# EasyEDA Pro project ProPrj_四关开Buck-Boost开关电路_V1.2_2026-08-30.epro

# Schematic Schematic1

## Sheets
1 辅助电源&主控芯片: Assembly Variant: Basic; Board Name: Board1; Create Date: 2025-11-25; Page Name: P1; Project Name: 四关开Buck-Boost开关电路; Schematic Name: Schematic1; Update Date: 2025-11-25; Company: 嘉立创EDA; Page Size: A4; Version: V1.0
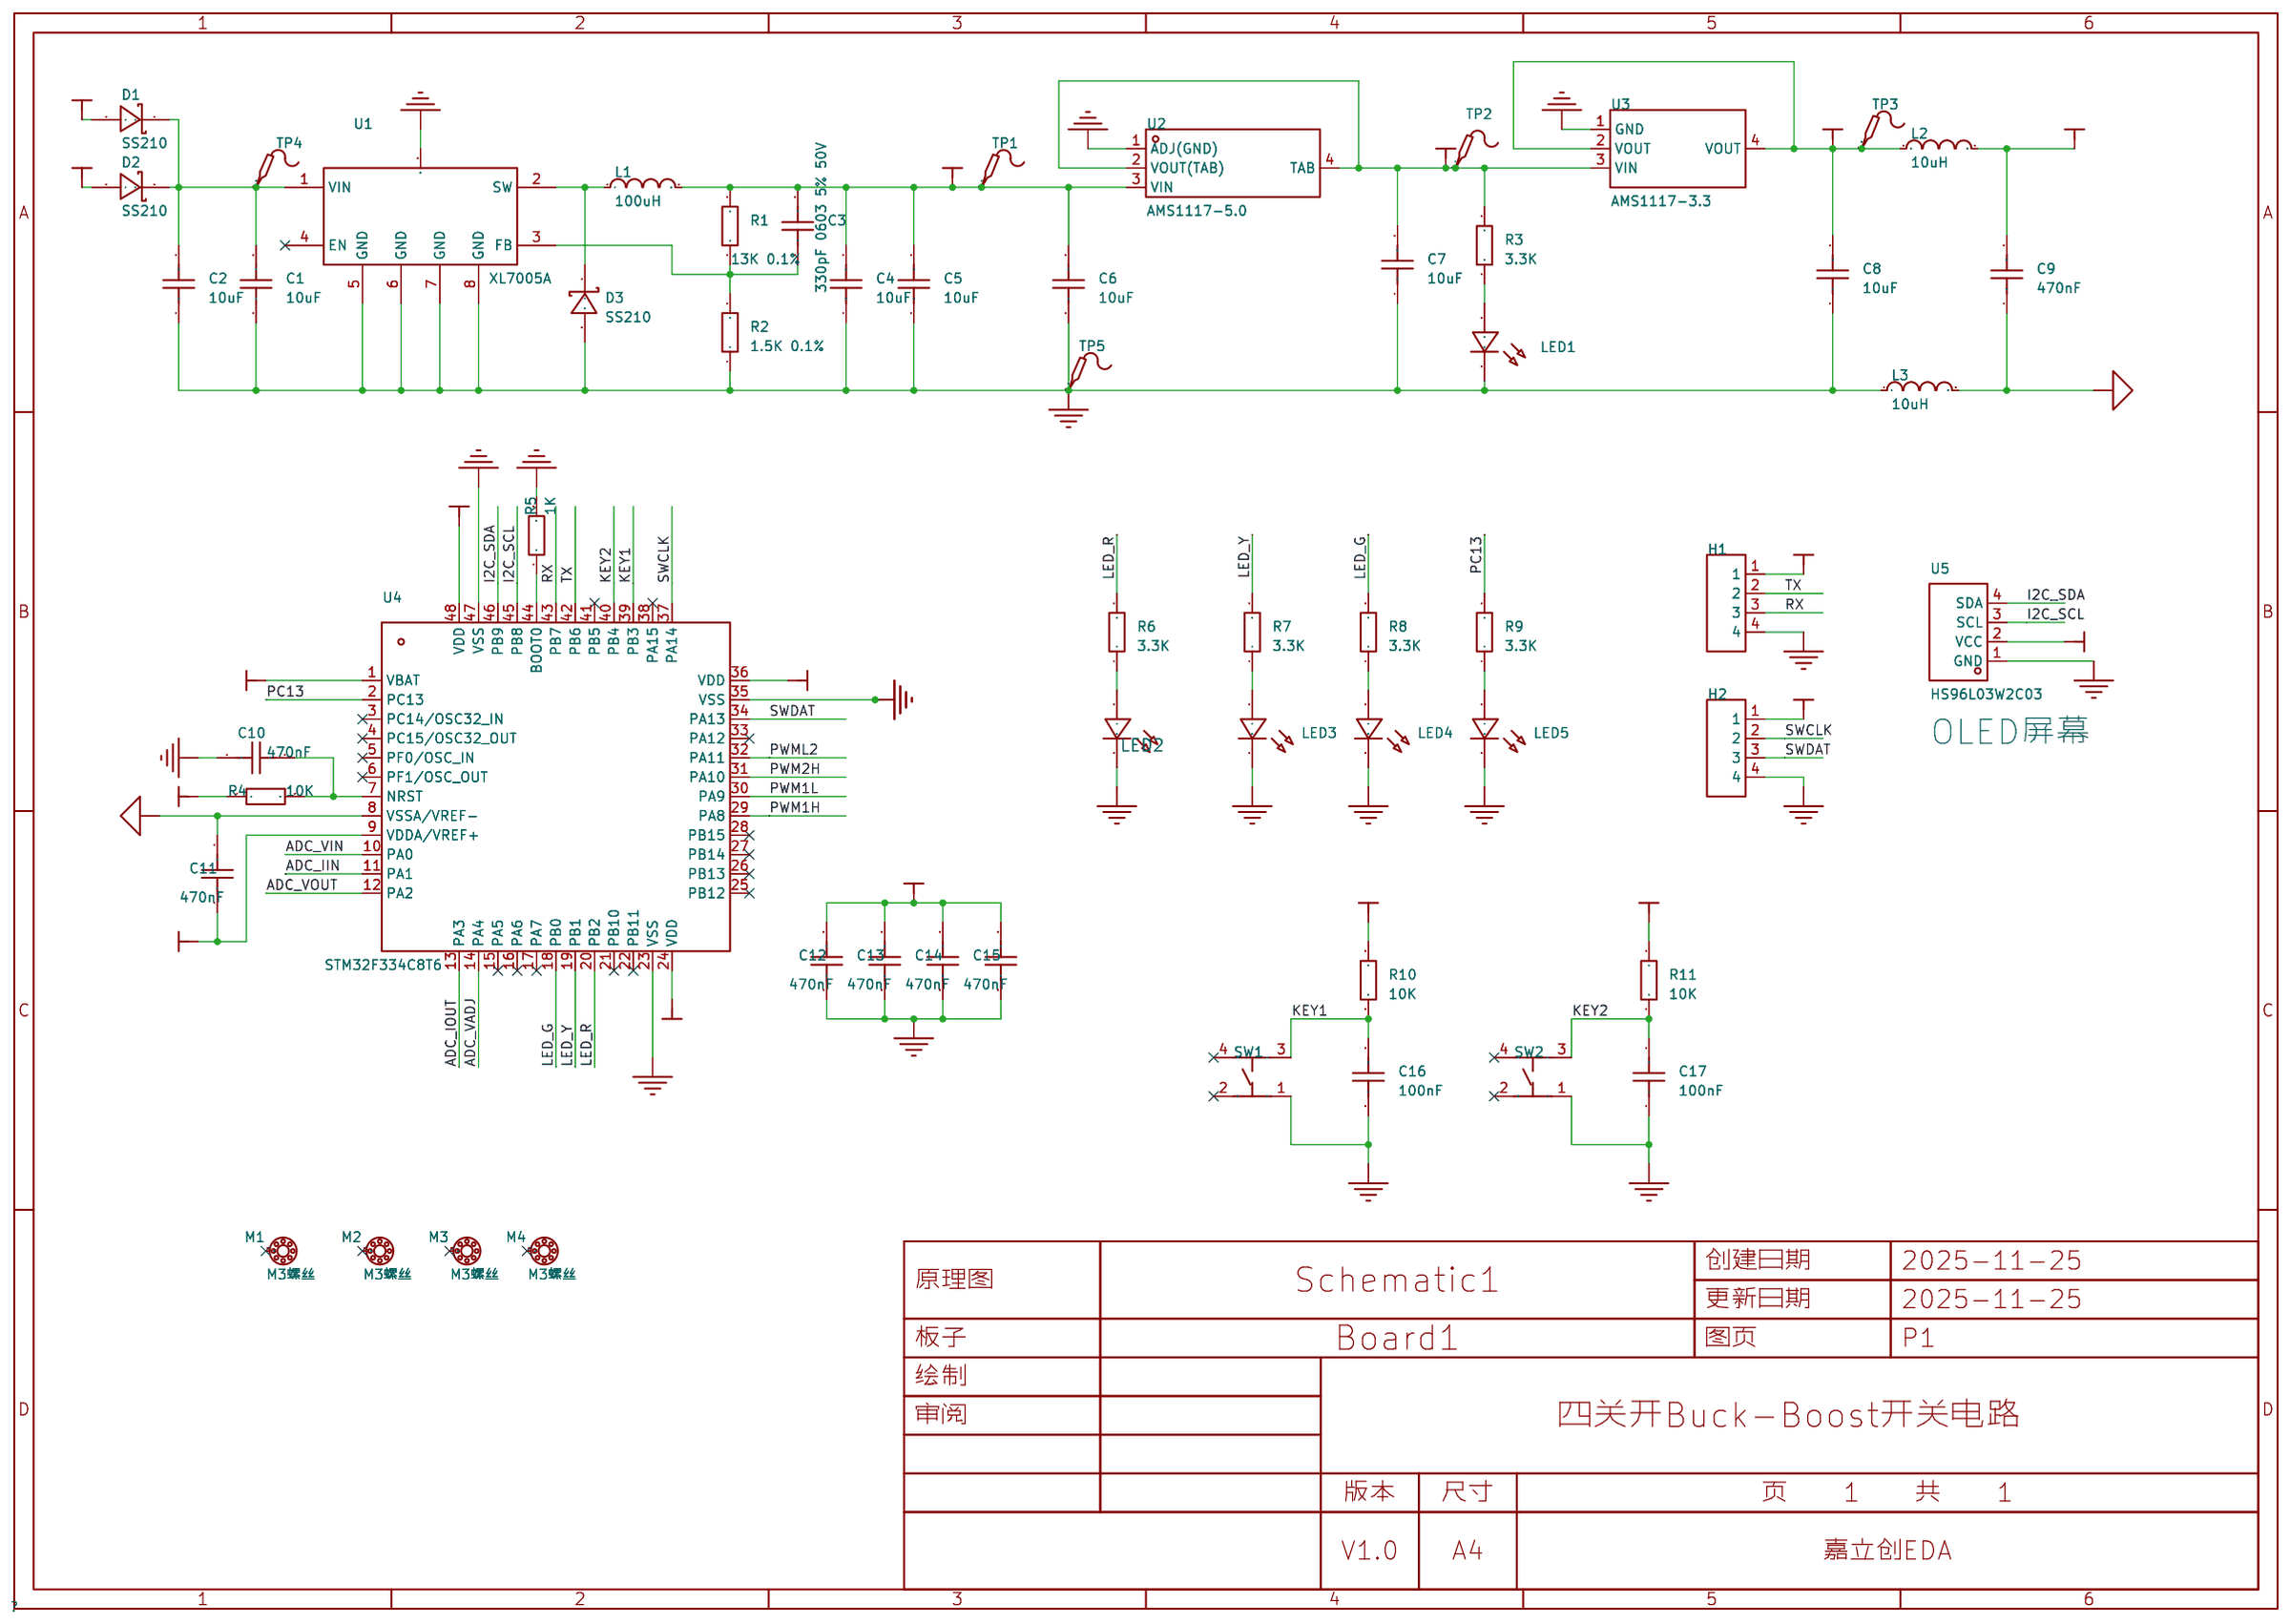
[diagram p0: 辅助电源&主控芯片]
2 主功率&驱动: Page Name: P2
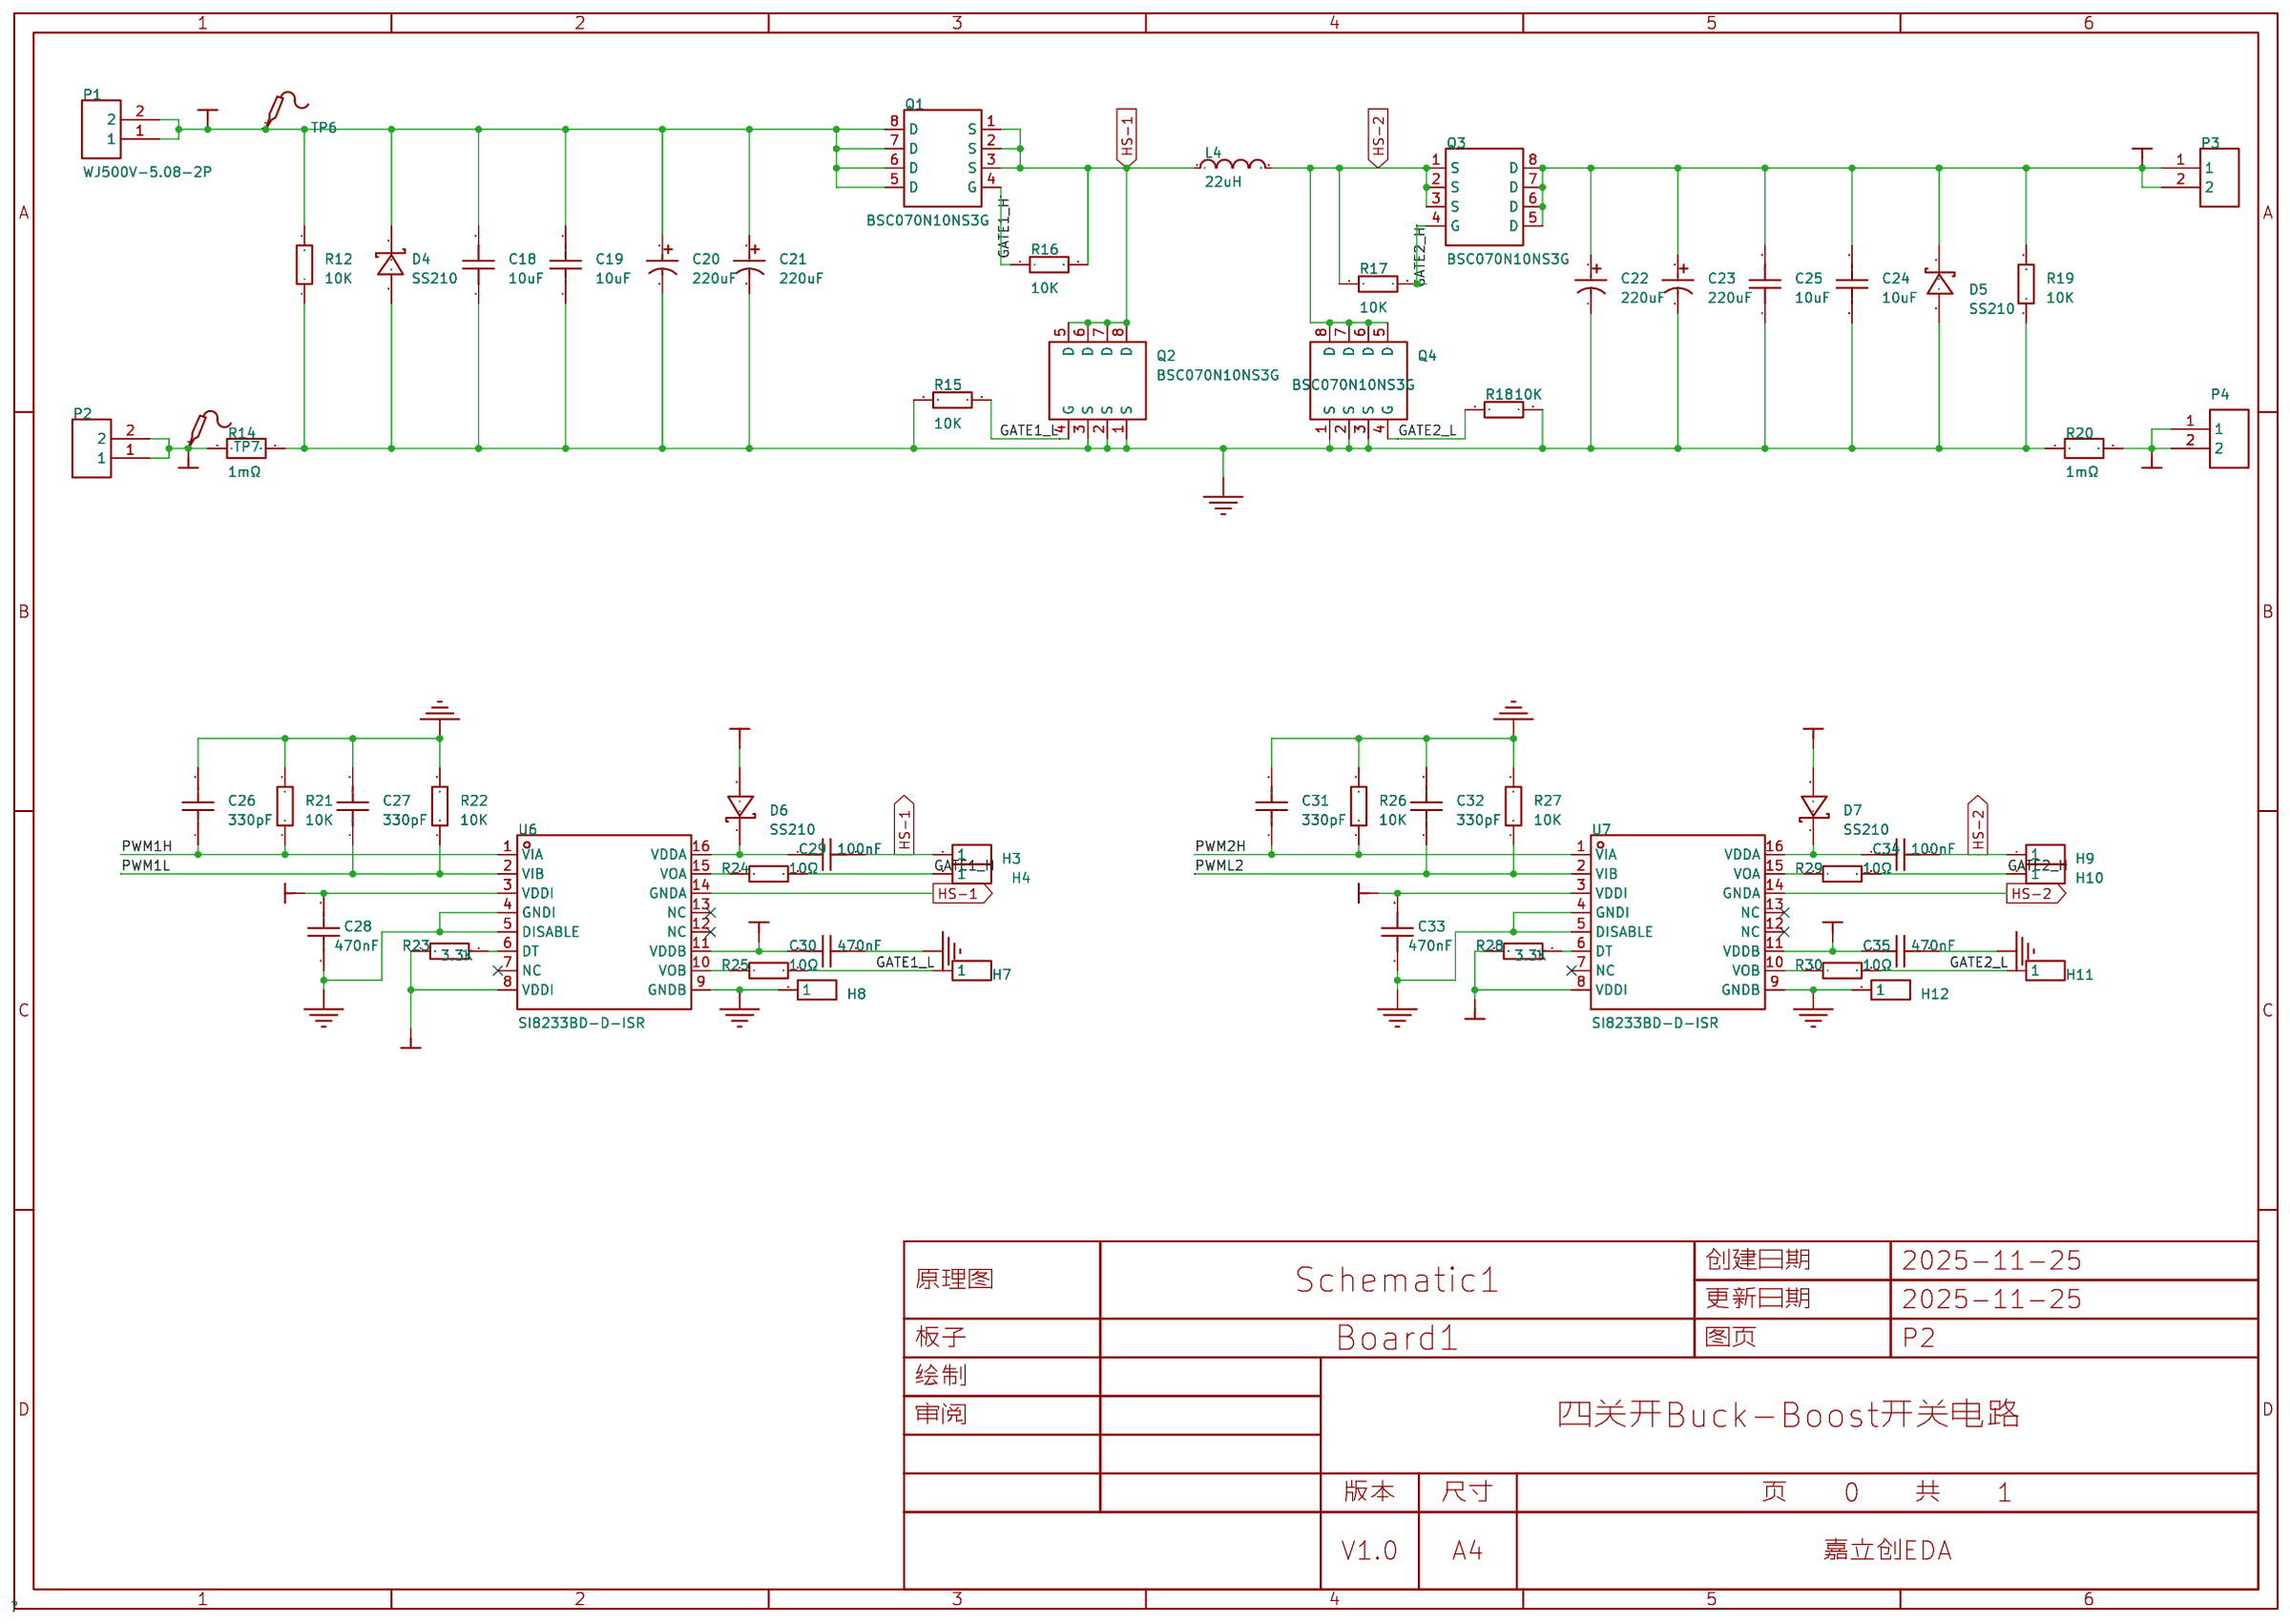
[diagram p1: 主功率&驱动]
3 信号处理: Create Date: 2025-11-26; Page Name: P3; Update Date: 2025-11-26
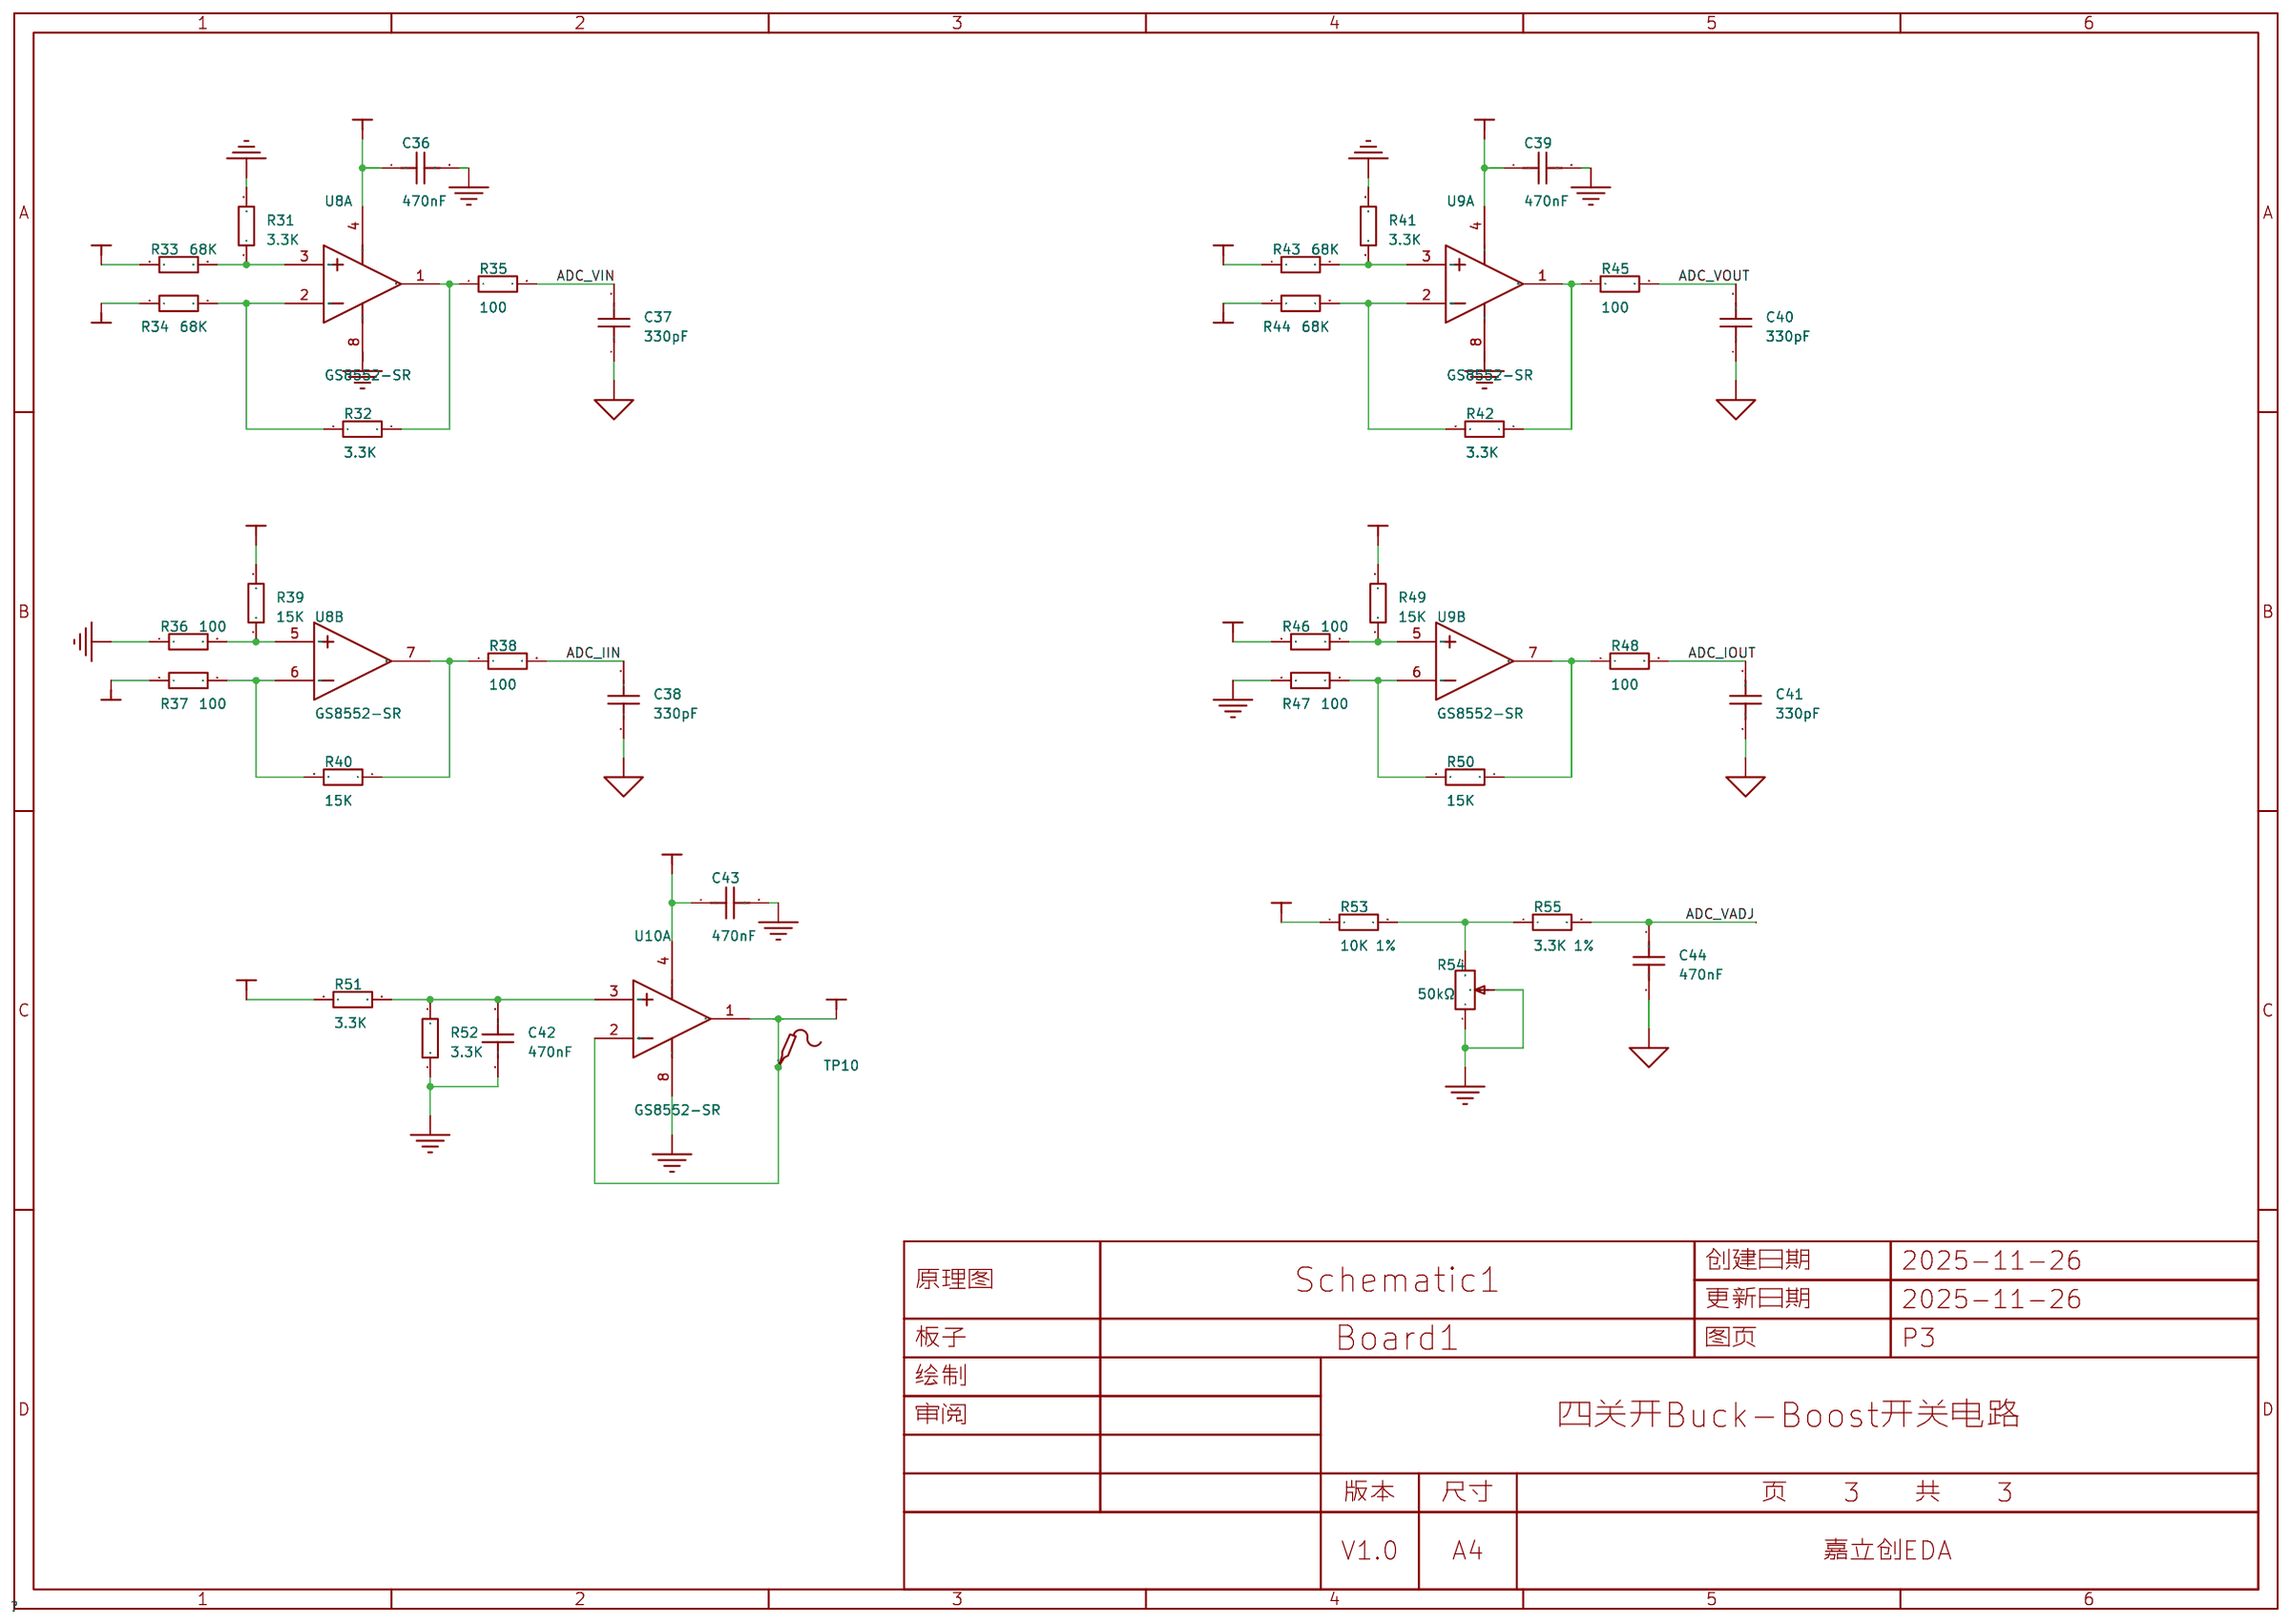
[diagram p2: 信号处理]

## Parts
sheet 主功率&驱动
C18  10uF  [C0805]
C19  10uF  [C0805]
C20  220uF  [CAP-TH_BD10.0-P5.00-D1.0-FD]
C21  220uF  [CAP-TH_BD10.0-P5.00-D1.0-FD]
C22  220uF  [CAP-TH_BD10.0-P5.00-D1.0-FD]
C23  220uF  [CAP-TH_BD10.0-P5.00-D1.0-FD]
C24  10uF  [C0805]
C25  10uF  [C0805]
C26  330pF  [C0603]
C27  330pF  [C0603]
C28  470nF  [C0603]
C29  100nF  [C0603]
C30  470nF  [C0603]
C31  330pF  [C0603]
C32  330pF  [C0603]
C33  470nF  [C0603]
C34  100nF  [C0603]
C35  470nF  [C0603]
D4  SS210  [SMA_L4.4-W2.8-LS5.4-RD]
D5  SS210  [SMA_L4.4-W2.8-LS5.4-RD]
D6  SS210  [SMA_L4.4-W2.8-LS5.4-RD]
D7  SS210  [SMA_L4.4-W2.8-LS5.4-RD]
H3  -  [HDR-TH_1P-V-M_XKB_X4611WV-01I-C28D40]
H4  -  [HDR-TH_1P-V-M_XKB_X4611WV-01I-C28D40]
H7  -  [HDR-TH_1P-V-M_XKB_X4611WV-01I-C28D40]
H8  -  [HDR-TH_1P-V-M_XKB_X4611WV-01I-C28D40]
H9  -  [HDR-TH_1P-V-M_XKB_X4611WV-01I-C28D40]
H10  -  [HDR-TH_1P-V-M_XKB_X4611WV-01I-C28D40]
H11  -  [HDR-TH_1P-V-M_XKB_X4611WV-01I-C28D40]
H12  -  [HDR-TH_1P-V-M_XKB_X4611WV-01I-C28D40]
L4  22uH  [IND-SMD_L17.5-W17.0_YXMAC1770]
P1  WJ500V-5.08-2P  [CONN-TH_2P-P5.00_WJ500V-5.08-2P]
P2  WJ500V-5.08-2P  [CONN-TH_2P-P5.00_WJ500V-5.08-2P]
P3  WJ500V-5.08-2P  [CONN-TH_2P-P5.00_WJ500V-5.08-2P]
P4  WJ500V-5.08-2P  [CONN-TH_2P-P5.00_WJ500V-5.08-2P]
Q1  BSC070N10NS3G  [PG-TDSON-8_L5.0-W6.0-P1.27-BL-EP]
Q2  BSC070N10NS3G  [PG-TDSON-8_L5.0-W6.0-P1.27-BL-EP]
Q3  BSC070N10NS3G  [PG-TDSON-8_L5.0-W6.0-P1.27-BL-EP]
Q4  BSC070N10NS3G  [PG-TDSON-8_L5.0-W6.0-P1.27-BL-EP]
R12  10K  [R0603]
R14  1mΩ  [RES-SMD_L6.3-W3.2_R2512]
R15  10K  [R0603]
R16  10K  [R0603]
R17  10K  [R0603]
R18  10K  [R0603]
R19  10K  [R0603]
R20  1mΩ  [RES-SMD_L6.3-W3.2_R2512]
R21  10K  [R0603]
R22  10K  [R0603]
R23  3.3K  [R0603]
R24  10Ω  [R0603]
R25  10Ω  [R0603]
R26  10K  [R0603]
R27  10K  [R0603]
R28  3.3K  [R0603]
R29  10Ω  [R0603]
R30  10Ω  [R0603]
TP6  -  [Test-Point-0.5mm]
TP7  -  [Test-Point-0.5mm]
U6  SI8233BD-D-ISR  [SOIC-16_L10.3-W7.5-P1.27-LS10.3-BL]
U7  SI8233BD-D-ISR  [SOIC-16_L10.3-W7.5-P1.27-LS10.3-BL]
sheet 信号处理
C36  470nF  [C0603]
C37  330pF  [C0603]
C38  330pF  [C0603]
C39  470nF  [C0603]
C40  330pF  [C0603]
C41  330pF  [C0603]
C42  470nF  [C0603]
C43  470nF  [C0603]
C44  470nF  [C0603]
R31  3.3K  [R0603]
R32  3.3K  [R0603]
R33  68K  [R0603]
R34  68K  [R0603]
R35  100  [R0603]
R36  100  [R0603]
R37  100  [R0603]
R38  100  [R0603]
R39  15K  [R0603]
R40  15K  [R0603]
R41  3.3K  [R0603]
R42  3.3K  [R0603]
R43  68K  [R0603]
R44  68K  [R0603]
R45  100  [R0603]
R46  100  [R0603]
R47  100  [R0603]
R48  100  [R0603]
R49  15K  [R0603]
R50  15K  [R0603]
R51  3.3K  [R0603]
R52  3.3K  [R0603]
R53  10K 1%  [R0603]
R54  50kΩ  [RES-ADJ-TH_3296W]
R55  3.3K 1%  [R0603]
TP10  -  [Test-Point-0.5mm]
U8  GS8552-SR  [SOIC-8_L4.9-W3.9-P1.27-LS6.0-BL]  (sections 1,2)
U9  GS8552-SR  [SOIC-8_L4.9-W3.9-P1.27-LS6.0-BL]  (sections 1,2)
U10  GS8552-SR  [SOIC-8_L4.9-W3.9-P1.27-LS6.0-BL]  (section 1)
sheet 辅助电源&主控芯片
C1  10uF  [C0805]
C2  10uF  [C0805]
C3  330pF 0603 5% 50V  [C0603]
C4  10uF  [C0805]
C5  10uF  [C0805]
C6  10uF  [C0805]
C7  10uF  [C0805]
C8  10uF  [C0805]
C9  470nF  [C0603]
C10  470nF  [C0603]
C11  470nF  [C0603]
C12  470nF  [C0603]
C13  470nF  [C0603]
C14  470nF  [C0603]
C15  470nF  [C0603]
C16  100nF  [C0603]
C17  100nF  [C0603]
D1  SS210  [SMA_L4.4-W2.8-LS5.4-RD]
D2  SS210  [SMA_L4.4-W2.8-LS5.4-RD]
D3  SS210  [SMA_L4.4-W2.8-LS5.4-RD]
H1  -  [HDR-TH_4P-P2.54-V-M]
H2  -  [HDR-TH_4P-P2.54-V-M]
L1  100uH  [IND-SMD_L6.0-W6.0_FNR60XXS]
L2  10uH  [L0603]
L3  10uH  [L0603]
LED1  -  [LED_0603]
LED2  -  [LED_0603]
LED3  -  [LED_0603]
LED4  -  [LED_0603]
LED5  -  [LED_0603]
M1  M3螺丝  [螺钉孔]
M2  M3螺丝  [螺钉孔]
M3  M3螺丝  [螺钉孔]
M4  M3螺丝  [螺钉孔]
R1  13K 0.1%  [R0603]
R2  1.5K 0.1%  [R0603]
R3  3.3K  [R0603]
R4  10K  [R0603]
R5  1K  [R0603]
R6  3.3K  [R0603]
R7  3.3K  [R0603]
R8  3.3K  [R0603]
R9  3.3K  [R0603]
R10  10K  [R0603]
R11  10K  [R0603]
SW1  KH-6X6X5H-STM  [SW-SMD_4P-L6.0-W6.0-P4.50-LS9.0_H5.0]
SW2  KH-6X6X5H-STM  [SW-SMD_4P-L6.0-W6.0-P4.50-LS9.0_H5.0]
TP1  -  [Test-Point-0.5mm]
TP2  -  [Test-Point-0.5mm]
TP3  -  [Test-Point-0.5mm]
TP4  -  [Test-Point-0.5mm]
TP5  -  [Test-Point-0.5mm]
U1  XL7005A  [SOIC-8_L4.9-W3.9-P1.27-LS6.0-BL-EP3.1-1]
U2  AMS1117-5.0  [SOT-223_L6.7-W3.5-P2.30-BR]
U3  AMS1117-3.3  [SOT-223-3_L6.5-W3.4-P2.30-LS7.0-BR]
U4  STM32F334C8T6  [LQFP-48_L7.0-W7.0-P0.50-LS9.0-BL]
U5  HS96L03W2C03  [OLED-TH_L27.8-W27.2-P2.54_C9900033791]

## Library data of the parts
C1 C2 C4-C8 C18 C19 C24 C25 = CAP_0805: Supplier Footprint: 0805
C20-C23 = GR227M063G17RR0VL4FP0: 容值:220uF;精度:±20%;额定电压:63V;纹波电流:-;等效串联电阻(ESR):-;; LCSC Part Name: 绿金 220uF ±20% 63V; Supplier Part: C47290; Manufacturer: Chengx(承兴); Supplier Footprint: 插件,D10xL17mm; JLCPCB Part Class: Extended Part; Datasheet: https://item.szlcsc.com/datasheet/GR227M063G17RR0VL4FP0/48295.html; Supplier: LCSC; Tolerance: ±20%; Voltage Rating: 63V; Pin Spacing: 5mm; Diameter: 10mm; Height - Seated (Max): 17mm; Lifetime: 3000hrs@105℃; Operating Temperature: -40℃~+105℃
C3 C9-C17 C26-C44 = CAP_0603: Supplier Footprint: 0603
D1-D7 = SS210: 正向压降(Vf):850mV@1A;直流反向耐压(Vr):100V;整流电流:2A;; LCSC Part Name: 电压:100V 电流:2A; Supplier Part: C306853; Manufacturer: BORN(伯恩半导体); Supplier Footprint: SMA(DO-214AC); JLCPCB Part Class: Extended Part; Datasheet: https://item.szlcsc.com/datasheet/SS210/290547.html; Supplier: LCSC; Voltage - Forward(Vf@If): 850mV@1A; Voltage - DC Reverse(Vr): 100V; Current - Rectified: 2A; Reverse Leakage Current (Ir): 500uA@100V; Operating Junction Temperature Range: -65℃~+125℃; Non-Repetitive Peak Forward Surge Current: 50A
H3 H4 H7-H12 = HDR-M_2.54_1x1P: Supplier Part: C81276; Supplier Footprint: 插件; JLCPCB Part Class: Extended Part
L4 = TMPA1707SP-220MN-D: 电感值:22uH;精度:±20%;额定电流:11.5A;饱和电流(Isat):11.5A;; LCSC Part Name: 22uH ±20% 11.5A; Supplier Part: C357120; Manufacturer: TAI-TECH(台庆); Supplier Footprint: SMD,17.8x16.9mm; JLCPCB Part Class: Extended Part; Datasheet: https://item.szlcsc.com/datasheet/TMPA1707SP-220MN-D/332225.html; Supplier: LCSC; Tolerance: ±20%; Current Rating: 11.5A; Current - Saturation(Isat): 11.5A; DC Resistance(DCR): 20.5mΩ
P1-P4 = WJ500V-5.08-2P: 结构:1x2P;间距:5.08mm;颜色:绿色;安装方式:直插;额定电流:18A;额定电压:250V;排数:1;线规 - AWG:14~30;线规 - 平方毫米:2.5;每排PIN数:2;触头材质:-;触头镀层:-;工作温度范围:-40℃~+105℃;焊接温度(最大值):-;; LCSC Part Name: 1x2P 5.08mm 直插 排数:1 每排P数:2; Supplier Part: C8465; Manufacturer: KANGNEX(康奈克斯电气); Supplier Footprint: 插件,P=5.08mm; JLCPCB Part Class: Extended Part; Datasheet: https://atta.szlcsc.com/upload/public/pdf/source/20191225/C8465_02D34CE5B5B4A53DF5891601D97FA9F4.pdf; Supplier: LCSC; Structure: 1x2P; Pitch: 5.08mm; Color: 绿色; Mounting Style: 直插; Current Rating (Max): 18A; Voltage Rating (Max): 250V; Number of Pins: 2P; Number of Rows: 1; Wire Gauge - AWG: 14~30; Wire Gauge - mm2: 2.5; Number of PINs Per Row: 2; Operating Temperature Range: -40℃~+105℃; Screw Specification: M2.5
Q1-Q4 = BSC070N10NS3G: 数量:1个N沟道;漏源电压(Vdss):100V;连续漏极电流(Id):90A;导通电阻(RDS(on)):7mΩ@10V,50A;耗散功率(Pd):114W;阈值电压(Vgs(th)):3.5V;; LCSC Part Name: 1个N沟道 耐压:100V 电流:90A; Supplier Part: C501502; Manufacturer: Infineon(英飞凌); Supplier Footprint: TDSON-8(5x6); JLCPCB Part Class: Extended Part; Datasheet: https://item.szlcsc.com/datasheet/BSC070N10NS3G/513940.html; Supplier: LCSC; Number: 1个N沟道; Drain to Source Voltage: 100V; Current - Continuous Drain(Id): 90A; RDS(on): 7mΩ@10V,50A; Pd - Power Dissipation: 114W; Gate Threshold Voltage (Vgs(th)): 3.5V; Gate Charge(Qg): 42nC@10V; Input Capacitance(Ciss): 3nF; Reverse Transfer Capacitance (Crss@Vds): 21pF; Operating Temperature: -55℃~+150℃; Type: N沟道; Output Capacitance(Coss): 520pF
R1-R12 R15-R19 R21-R53 R55 = Res_0603: Supplier Footprint: 0603
R14 R20 = RE2512F3R001: 电阻类型:采样电阻；合金电阻;阻值:1mΩ;精度:±1%;功率:3W;温度系数:±50ppm/℃;; LCSC Part Name: 1mΩ 3W 2512 ±1%; Supplier Part: C46961745; Manufacturer: JIERR(捷而瑞); Supplier Footprint: 2512; JLCPCB Part Class: Extended Part; Datasheet: https://item.szlcsc.com/datasheet/RE2512F3R001/49133284.html; Supplier: LCSC; Type: 采样电阻；合金电阻; Tolerance: ±1%; Power(Watts): 3W; Temperature Coefficient: ±50ppm/℃
TP1-TP7 TP10 = Test-Point: Test Point 测试点
U6 U7 = SI8233BD-D-ISR: 隔离栅极驱动; Supplier Part: C461840; Manufacturer: SKYWORKS/SILICON LABS(芯科); Supplier Footprint: SOIC-16-300mil; JLCPCB Part Class: Extended Part; Datasheet: https://item.szlcsc.com/datasheet/SI8233BD-D-ISR/466323.html; Supplier: LCSC; Number of Forward Channels: 2; Number of Reverse Channels: 2; Default Output: 低电平; Isolation Voltage(Vrms): 5000; CMTI(kV/us): 45kV/us; Operating Temperature: -40℃~+125℃; Rating: 工业级
R54 = 3296W-1-503LF_C49190466: 阻值:50kΩ;精度:±10%;功率:500mW;温度系数:±150ppm/℃;; LCSC Part Name: 3296W-1-503LF; Supplier Part: C49190466; Manufacturer: JIERR(捷而瑞); Manufacturer Part: 3296W-1-503LF; Supplier Footprint: 插件-3P,9.5x4.9mm; JLCPCB Part Class: Extended Part; Datasheet: https://item.szlcsc.com/datasheet/3296W-1-503LF/51587059.html; Supplier: LCSC; Tolerance: ±10%; Power(Watts): 500mW; Temperature Coefficient: ±150ppm/℃; Number of Turns: 28
U8-U10 = GS8552-SR: 放大器数:双路;增益带宽积(GBP):1.8MHz;输入偏置电流(Ib):20pA;输入失调电压(Vos):30uV;压摆率(SR):0.95V/us;轨到轨:轨到轨输入,轨到轨输出;; LCSC Part Name: 带射频滤波器的1.8MHz零漂移CMOS轨到轨输入输出运算放大器; Supplier Part: C157716; Manufacturer: Gainsil(聚洵); Supplier Footprint: SOIC-8; JLCPCB Part Class: Extended Part; Datasheet: https://item.szlcsc.com/datasheet/GS8552-SR/169064.html; Supplier: LCSC; Number of Channels: 双路; Gain Bandwidth Product: 1.8MHz; Ib - Input Bias Current: 20pA; Vos - Input Offset Voltage: 30uV; Common Mode Rejection Ratio(CMRR): 110dB; Slew Rate: 0.95V/us; Output Current: 65mA; Rail to Rail: 轨到轨输入,轨到轨输出; Input Offset Voltage Drift(Vos TC): 10nV/℃; Quiescent Current(Iq): 180uA; Operating Temperature: -40℃~+125℃; Single Supply: 1.8V~5.5V; Dual Supply: 900mV~2.75V；-2.75V~-900mV; Maximum Power Supply Range (Vdd-Vss): 5.5V; Noise density(eN): 38nV/√Hz@1kHz; Input Offset Current(Ios): 10pA
H1 H2 = HDR-M_2.54_1x4P: Supplier Part: C492403; Supplier Footprint: 插件
L1 = FNR6045S101MT: 电感值:100uH;精度:±20%;额定电流:880mA;饱和电流(Isat):1A;类型:磁胶屏蔽绕线合金电感;; LCSC Part Name: 100uH ±20% 1A; Supplier Part: C168095; Manufacturer: cjiang(长江微电); Supplier Footprint: SMD,6x6mm; JLCPCB Part Class: Extended Part; Datasheet: https://atta.szlcsc.com/upload/public/pdf/source/20190327/C167925_9EFF0AABC4CA629C2CC95961DBF7D39D.pdf; Supplier: LCSC; Tolerance: ±20%; Current Rating: 880mA; Current - Saturation(Isat): 1A; DC Resistance(DCR): 563mΩ; Type: 磁胶屏蔽绕线合金电感
L2 L3 = L_0603
LED1 LED4 LED5 = LED_0603-G: Supplier Footprint: 0603
LED2 = LED_0603-R: Supplier Footprint: 0603
LED3 = LED_0603-B: Supplier Footprint: 0603
M1-M4 = M3螺丝: Pin Type: IN
SW1 SW2 = KH-6X6X5H-STM: 电路结构:单刀单掷;按钮形状:圆形按钮;安装方式:立贴;开关长度:6mm;开关宽度:6mm;开关高度:5mm;带支架:不带支架;触点电流:50mA;额定电压:12V;工作寿命:8万次;; LCSC Part Name: 6*6*5mm 立贴 轻触开关; Supplier Part: C2837531; Manufacturer: kinghelm(金航标); Supplier Footprint: SMD-4P,6x6mm; JLCPCB Part Class: Extended Part; Datasheet: https://item.szlcsc.com/datasheet/KH-6X6X5H-STM/3009601.html; Supplier: LCSC; Circuit: 单刀单掷; Actuator Style: 圆形按钮; Mounting Type: 立贴; Length: 6mm; Width: 6mm; Switch Height: 5mm; with Bracket: 不带支架; Contact Current: 50mA; Voltage Rating: 12V; Actuator/Cap Color: 黑色; Termination Style: 鸥翼型; Life: 8万次
U1 = XL7005A: 功能类型:降压型;工作电压:5V~80V;输出电压:1.25V~20V;输出电流:400mA;输出类型:可调;; LCSC Part Name: 0.4A 150kHz 80V 降压型DC-DC转换器; Supplier Part: C50848; Manufacturer: XLSEMI(芯龙); Supplier Footprint: SOIC-8-EP; JLCPCB Part Class: Extended Part; Datasheet: https://item.szlcsc.com/datasheet/XL7005A/51859.html; Supplier: LCSC; Function: 降压型; Voltage - Supply: 5V~80V; Output Voltage: 1.25V~20V; Output Current: 400mA; Frequency - Switching: 150kHz; Operating Temperature: -40℃~+125℃@(TJ); Synchronous Rectifier: 否; Number of Outputs: 1; Topology: 降压式; Quiescent Current: 2.5mA; Switch tube (built-in/external): 内置; Output Type: 可调
U2 = AMS1117-5.0_C347223: 输出类型:固定;工作电压:18V;输出电压:5V;输出电流:1A;电源纹波抑制比(PSRR):60dB@(120Hz);输出极性:正极;; LCSC Part Name: 输出:5V 电流:1A 耐压:12V; Supplier Part: C347223; Manufacturer: UMW(友台半导体); Supplier Footprint: SOT-223; JLCPCB Part Class: Extended Part; Datasheet: https://atta.szlcsc.com/upload/public/pdf/source/20241218/BAF0263FA2E44BCD8AF41AA4FA04EFAA.pdf; Supplier: LCSC; Output Type: 固定; Maximum Input Voltage: 18V; Output Voltage: 5V; Output Current: 1A; Power Supply Rejection Ratio (PSRR): 60dB@(120Hz); Dropout Voltage: 1.3V@(1A); Feature: 过流保护(OCP); Output Polarity: 正极; Number of Outputs: 1
U3 = AMS1117-3.3_C6186: 输出类型:固定;工作电压:16V;输出电压:3.3V;输出电流:1A;电源纹波抑制比(PSRR):72dB@(120Hz);输出极性:正极;; LCSC Part Name: 输出3.3V 1A; Supplier Part: C6186; Manufacturer: AMS; Supplier Footprint: SOT-223; JLCPCB Part Class: Basic Part; Datasheet: https://item.szlcsc.com/datasheet/AMS1117-3.3/6652.html; Supplier: LCSC; Output Type: 固定; Voltage - Supply: 16V; Output Voltage: 3.3V; Output Current: 1A; Power Supply Rejection Ratio (PSRR): 72dB@(120Hz); Voltage Dropout: 1.1V@(800mA); standby current: 5mA; Noise: 0.003%Vout; Features: 过流保护；过热保护; Operating Temperature: -40℃~+125℃; Output Configuration: 正极; Number of Outputs: 1
U4 = STM32F334C8T6: CPU内核:ARM-M4;CPU最大主频:72MHz;应用领域:-;; LCSC Part Name: 带DSP和FPU的主流混合信号ARM Cortex-M4 MCU，具有64 KB Flash、72 MHz CPU、CCM、5 Msps 12位ADC、比较器、运算放大器和高分辨率定时器; Supplier Part: C99450; Manufacturer: ST(意法半导体); Supplier Footprint: LQFP-48(7x7); JLCPCB Part Class: Extended Part; Datasheet: https://item.szlcsc.com/datasheet/STM32F334C8T6/100664.html; Supplier: LCSC; CPU Core: ARM-M4; CPU Maximum Speed: 72MHz; Program Storage Size: 64KB; Program Memory Type: FLASH; Number of I/O: 37; ADC (Bit): 12bit; DAC (Bit): 12bit; Voltage - Supply: 2V~3.6V
U5 = HS96L03W2C03: 主控芯片:SSD1315;接口类型:I2C;尺寸(inch):0.96;像素分辨率:128x64;; LCSC Part Name: 0.96寸OLED显示屏窄白光IIC; Supplier Part: C5248080; Manufacturer: HS(汉昇); JLCPCB Part Class: Extended Part; Datasheet: https://atta.szlcsc.com/upload/public/pdf/source/20230627/763D01F79A90007632F098068C7C8AD9.pdf; Supplier: LCSC; Main Control Chip: SSD1315; Interface Type: I2C; Size: 0.96; Pixel Resolution: 128x64; Operating Temperature: -40℃~+70℃

## Nets
1V65: R39.2 R49.2 TP10.1 U10.1(OUT) U10.2(INVERTING INPUT)
3V3: C8.2 C12.2 C13.2 C14.2 C15.2 L2.1 R4.1 R10.2 R11.2 R51.1 R53.1 TP3.1 U3.2(VOUT) U3.4(VOUT) U4.1(VBAT) U4.24(VDD) U4.36(VDD) U4.48(VDD)
+5V: C7.2 C28.2 C33.2 C36.1 C39.1 C43.1 H1.1 H2.1 R3.2 R23.1 R28.1 TP2.1 U2.2(VOUT(TAB)) U2.4(TAB) U3.3(VIN) U5.2(VCC) U6.3(VDDI) U6.8(VDDI) U7.3(VDDI) U7.8(VDDI) U8.4(-V) U9.4(-V) U10.4(-V)
+12V: C3.2 C4.2 C5.2 C6.2 C30.1 C35.1 D6.2(A) D7.2(A) L1.2 R1.2 TP1.1 U2.3(VIN) U6.11(VDDB) U7.11(VDDB)
A3V3: C9.2 C11.1 L2.2 U4.9(VDDA/VREF+)
AGND: C9.1 C11.2 C37.1 C38.1 C40.1 C41.1 C44.1 L3.2 U4.8(VSSA/VREF-)
GND: C1.1 C2.1 C4.1 C5.1 C6.1 C7.1 C8.1 C10.1 C12.1 C13.1 C14.1 C15.1 C16.1 C17.1 C18.1 C19.1 C20.2 C21.2 C22.2 C23.2 C24.1 C25.1 C26.2 C27.2 C28.1 C30.2 C31.2 C32.2 C33.1 C35.2 C36.2 C39.2 C42.1 C43.2 D3.2(A) D4.2(A) D5.2(A) H1.4 H2.4 H8.1 H12.1 L3.1 LED1.1(C) LED2.1(C) LED3.1(C) LED4.1(C) LED5.1(C) Q2.1(S) Q2.2(S) Q2.3(S) Q4.1(S) Q4.2(S) Q4.3(S) R2.1 R5.2 R12.1 R14.2 R15.1 R18.2 R19.1 R20.1 R21.2 R22.2 R26.2 R27.2 R31.2 R36.1 R41.2 R47.1 R52.1 R54.1 R54.2 SW1.1 SW2.1 TP5.1 U1.5(GND) U1.6(GND) U1.7(GND) U1.8(GND) U1.9 U2.1(ADJ(GND)) U3.1(GND) U4.23(VSS) U4.35(VSS) U4.47(VSS) U5.1(GND) U6.4(GNDI) U6.5(DISABLE) U6.9(GNDB) U7.4(GNDI) U7.5(DISABLE) U7.9(GNDB) U8.8(+V) U9.8(+V) U10.8(+V)
VIN+: C18.2 C19.2 C20.1 C21.1 D2.2(A) D4.1(K) P1.1 P1.2 Q1.5(D) Q1.6(D) Q1.7(D) Q1.8(D) R12.2 R33.1 TP6.1
VIN-: P2.1 P2.2 R14.1 R34.1 R37.1 TP7.1
ADC_IIN: C38.2 R38.2 U4.11(PA1)
ADC_IOUT: C41.2 R48.2 U4.13(PA3)
ADC_VADJ: C44.2 R55.2 U4.14(PA4)
ADC_VIN: C37.2 R35.2 U4.10(PA0)
ADC_VOUT: C40.2 R45.2 U4.12(PA2)
GATE1_H: H4.1 Q1.4(G) R16.1 R24.2
GATE1_L: H7.1 Q2.4(G) R15.2 R25.2
GATE2_H: H10.1 Q3.4(G) R17.2 R29.2
GATE2_L: H11.1 Q4.4(G) R18.1 R30.2
HS-1: C29.2 H3.1 L4.1 Q1.1(S) Q1.2(S) Q1.3(S) Q2.5(D) Q2.6(D) Q2.7(D) Q2.8(D) R16.2 U6.14(GNDA)
HS-2: C34.2 H9.1 L4.2 Q3.1(S) Q3.2(S) Q3.3(S) Q4.5(D) Q4.6(D) Q4.7(D) Q4.8(D) R17.1 U7.14(GNDA)
I2C_SCL: U4.45(PB8) U5.3(SCL)
I2C_SDA: U4.46(PB9) U5.4(SDA)
KEY1: C16.2 R10.1 SW1.3 U4.39(PB3)
KEY2: C17.2 R11.1 SW2.3 U4.40(PB4)
LED_G: R8.2 U4.18(PB0)
LED_R: R6.2 U4.20(PB2)
LED_Y: R7.2 U4.19(PB1)
PC13: R9.2 U4.2(PC13)
PWM1H: C26.1 R21.1 U4.29(PA8) U6.1(VIA)
PWM1L: C27.1 R22.1 U4.30(PA9) U6.2(VIB)
PWM2H: C31.1 R26.1 U4.31(PA10) U7.1(VIA)
PWML2: C32.1 R27.1 U4.32(PA11) U7.2(VIB)
RX: H1.3 U4.43(PB7)
SWCLK: H2.2 U4.37(PA14)
SWDAT: H2.3 U4.34(PA13)
TX: H1.2 U4.42(PB6)
VOUT+: C22.1 C23.1 C24.2 C25.2 D1.2(A) D5.1(K) P3.1 P3.2 Q3.5(D) Q3.6(D) Q3.7(D) Q3.8(D) R19.2 R43.1
VOUT-: P4.1 P4.2 R20.2 R44.1 R46.1
$1N9: C1.2 C2.2 D1.1(K) D2.1(K) TP4.1 U1.1(VIN)
$1N11: D3.1(K) L1.1 U1.2(SW)
$1N12: C3.1 R1.1 R2.2 U1.3(FB)
$1N21: LED1.2(A) R3.1
$1N36: R5.1 U4.44(BOOT0)
$1N39: C10.2 R4.2 U4.7(NRST)
$1N69: LED2.2(A) R6.1
$1N71: LED3.2(A) R7.1
$1N72: LED5.2(A) R9.1
$1N76: LED4.2(A) R8.1
$2N110: R23.2 U6.6(DT)
$2N113: C29.1 D6.1(K) U6.16(VDDA)
$2N115: R24.1 U6.15(VOA)
$2N122: R25.1 U6.10(VOB)
$2N125: R30.1 U7.10(VOB)
$2N131: R29.1 U7.15(VOA)
$2N133: C34.1 D7.1(K) U7.16(VDDA)
$2N136: R28.2 U7.6(DT)
$3N6: R31.1 R33.2 U8.3(NONINVERTING INPUT)
$3N7: R32.2 R34.2 U8.2(INVERTING INPUT)
$3N10: R32.1 R35.1 U8.1(OUT)
$3N14: R36.2 R39.1 U8.5(NONINVERTING INPUT)
$3N18: R38.1 R40.1 U8.7(OUT)
$3N20: R37.2 R40.2 U8.6(INVERTING INPUT)
$3N21: R47.2 R50.2 U9.6(INVERTING INPUT)
$3N23: R48.1 R50.1 U9.7(OUT)
$3N26: R46.2 R49.1 U9.5(NONINVERTING INPUT)
$3N30: R42.1 R45.1 U9.1(OUT)
$3N33: R42.2 R44.2 U9.2(INVERTING INPUT)
$3N34: R41.1 R43.2 U9.3(NONINVERTING INPUT)
$3N40: C42.2 R51.2 R52.2 U10.3(NONINVERTING INPUT)
$3N50: R53.2 R54.3 R55.1

Not connected (* = marked no-connect by the designer): M1 1*; M2 1*; M3 1*; M4 1*; SW1 2* 4*; SW2 2* 4*; U1 4(EN)*; U4 3(PC14/OSC32_IN)* 4(PC15/OSC32_OUT)* 5(PF0/OSC_IN)* 6(PF1/OSC_OUT)* 15(PA5)* 16(PA6)* 17(PA7)* 21(PB10)* 22(PB11)* 25(PB12)* 26(PB13)* 27(PB14)* 28(PB15)* 33(PA12)* 38(PA15)* 41(PB5)*; U6 7(NC)* 12(NC)* 13(NC)*; U7 7(NC)* 12(NC)* 13(NC)*

## Notes on the sheets
sheet 1
- OLED屏幕

# Board PCB1
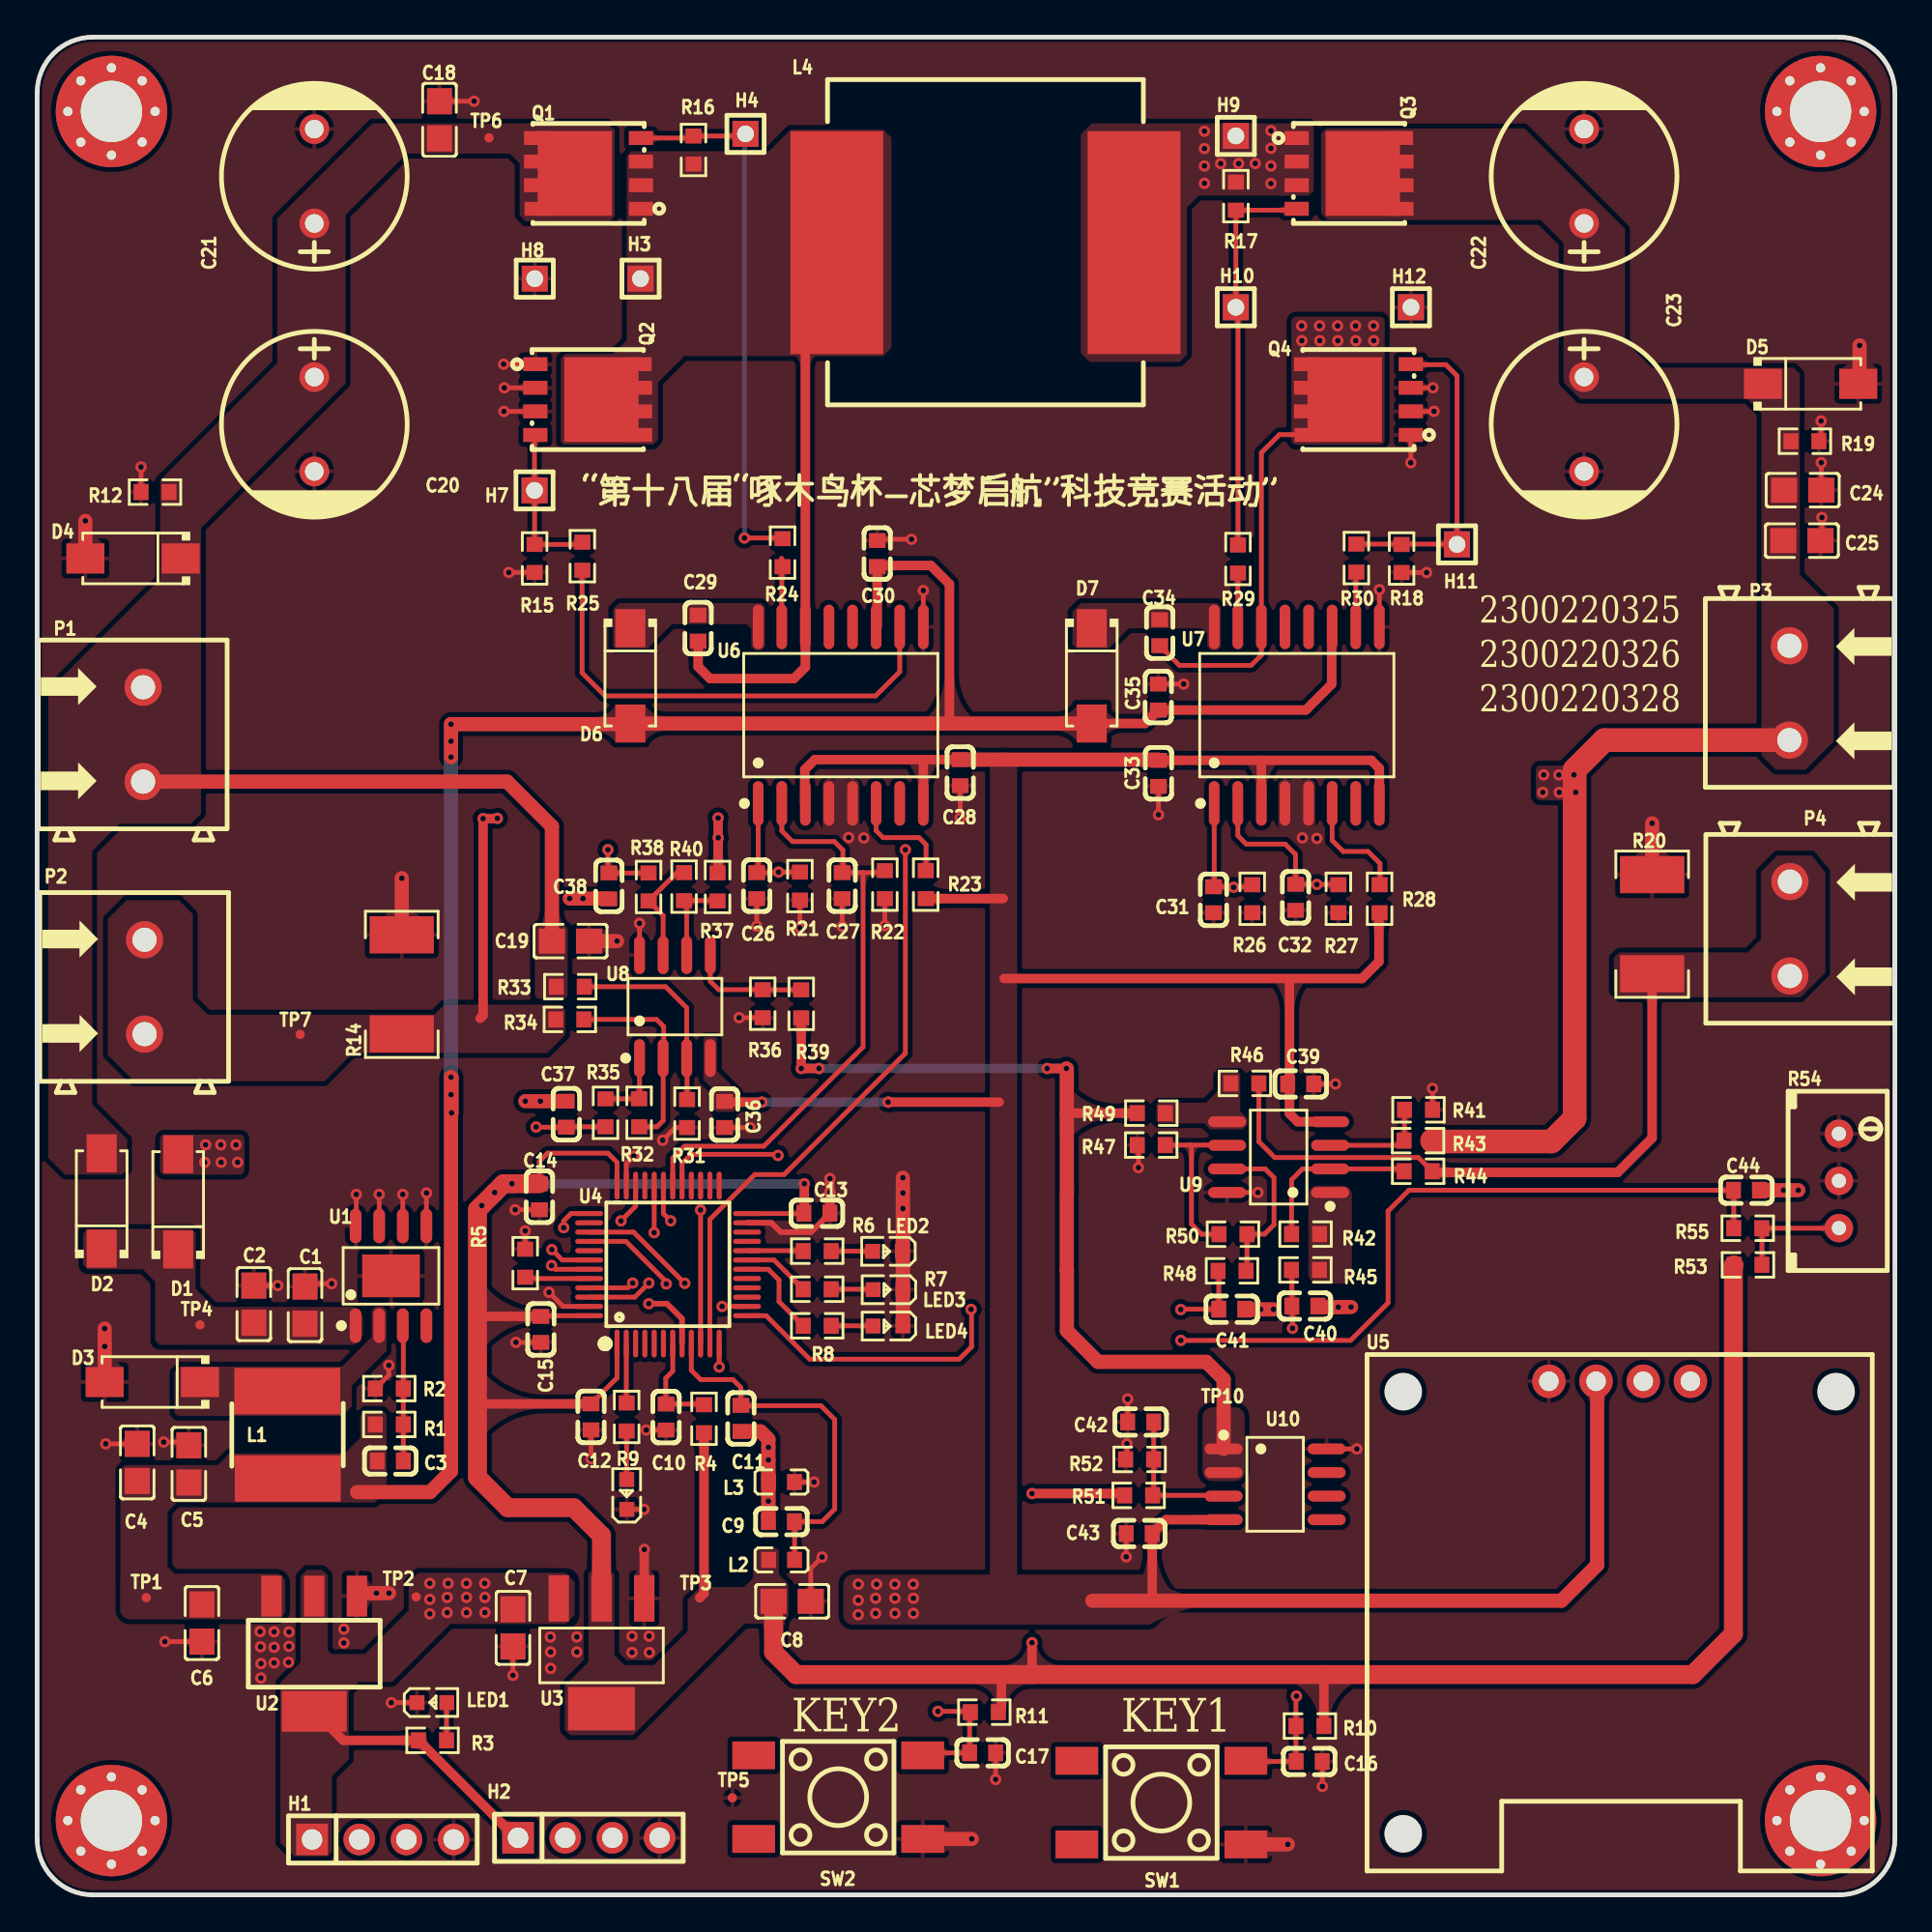
[diagram p3: board, top side]
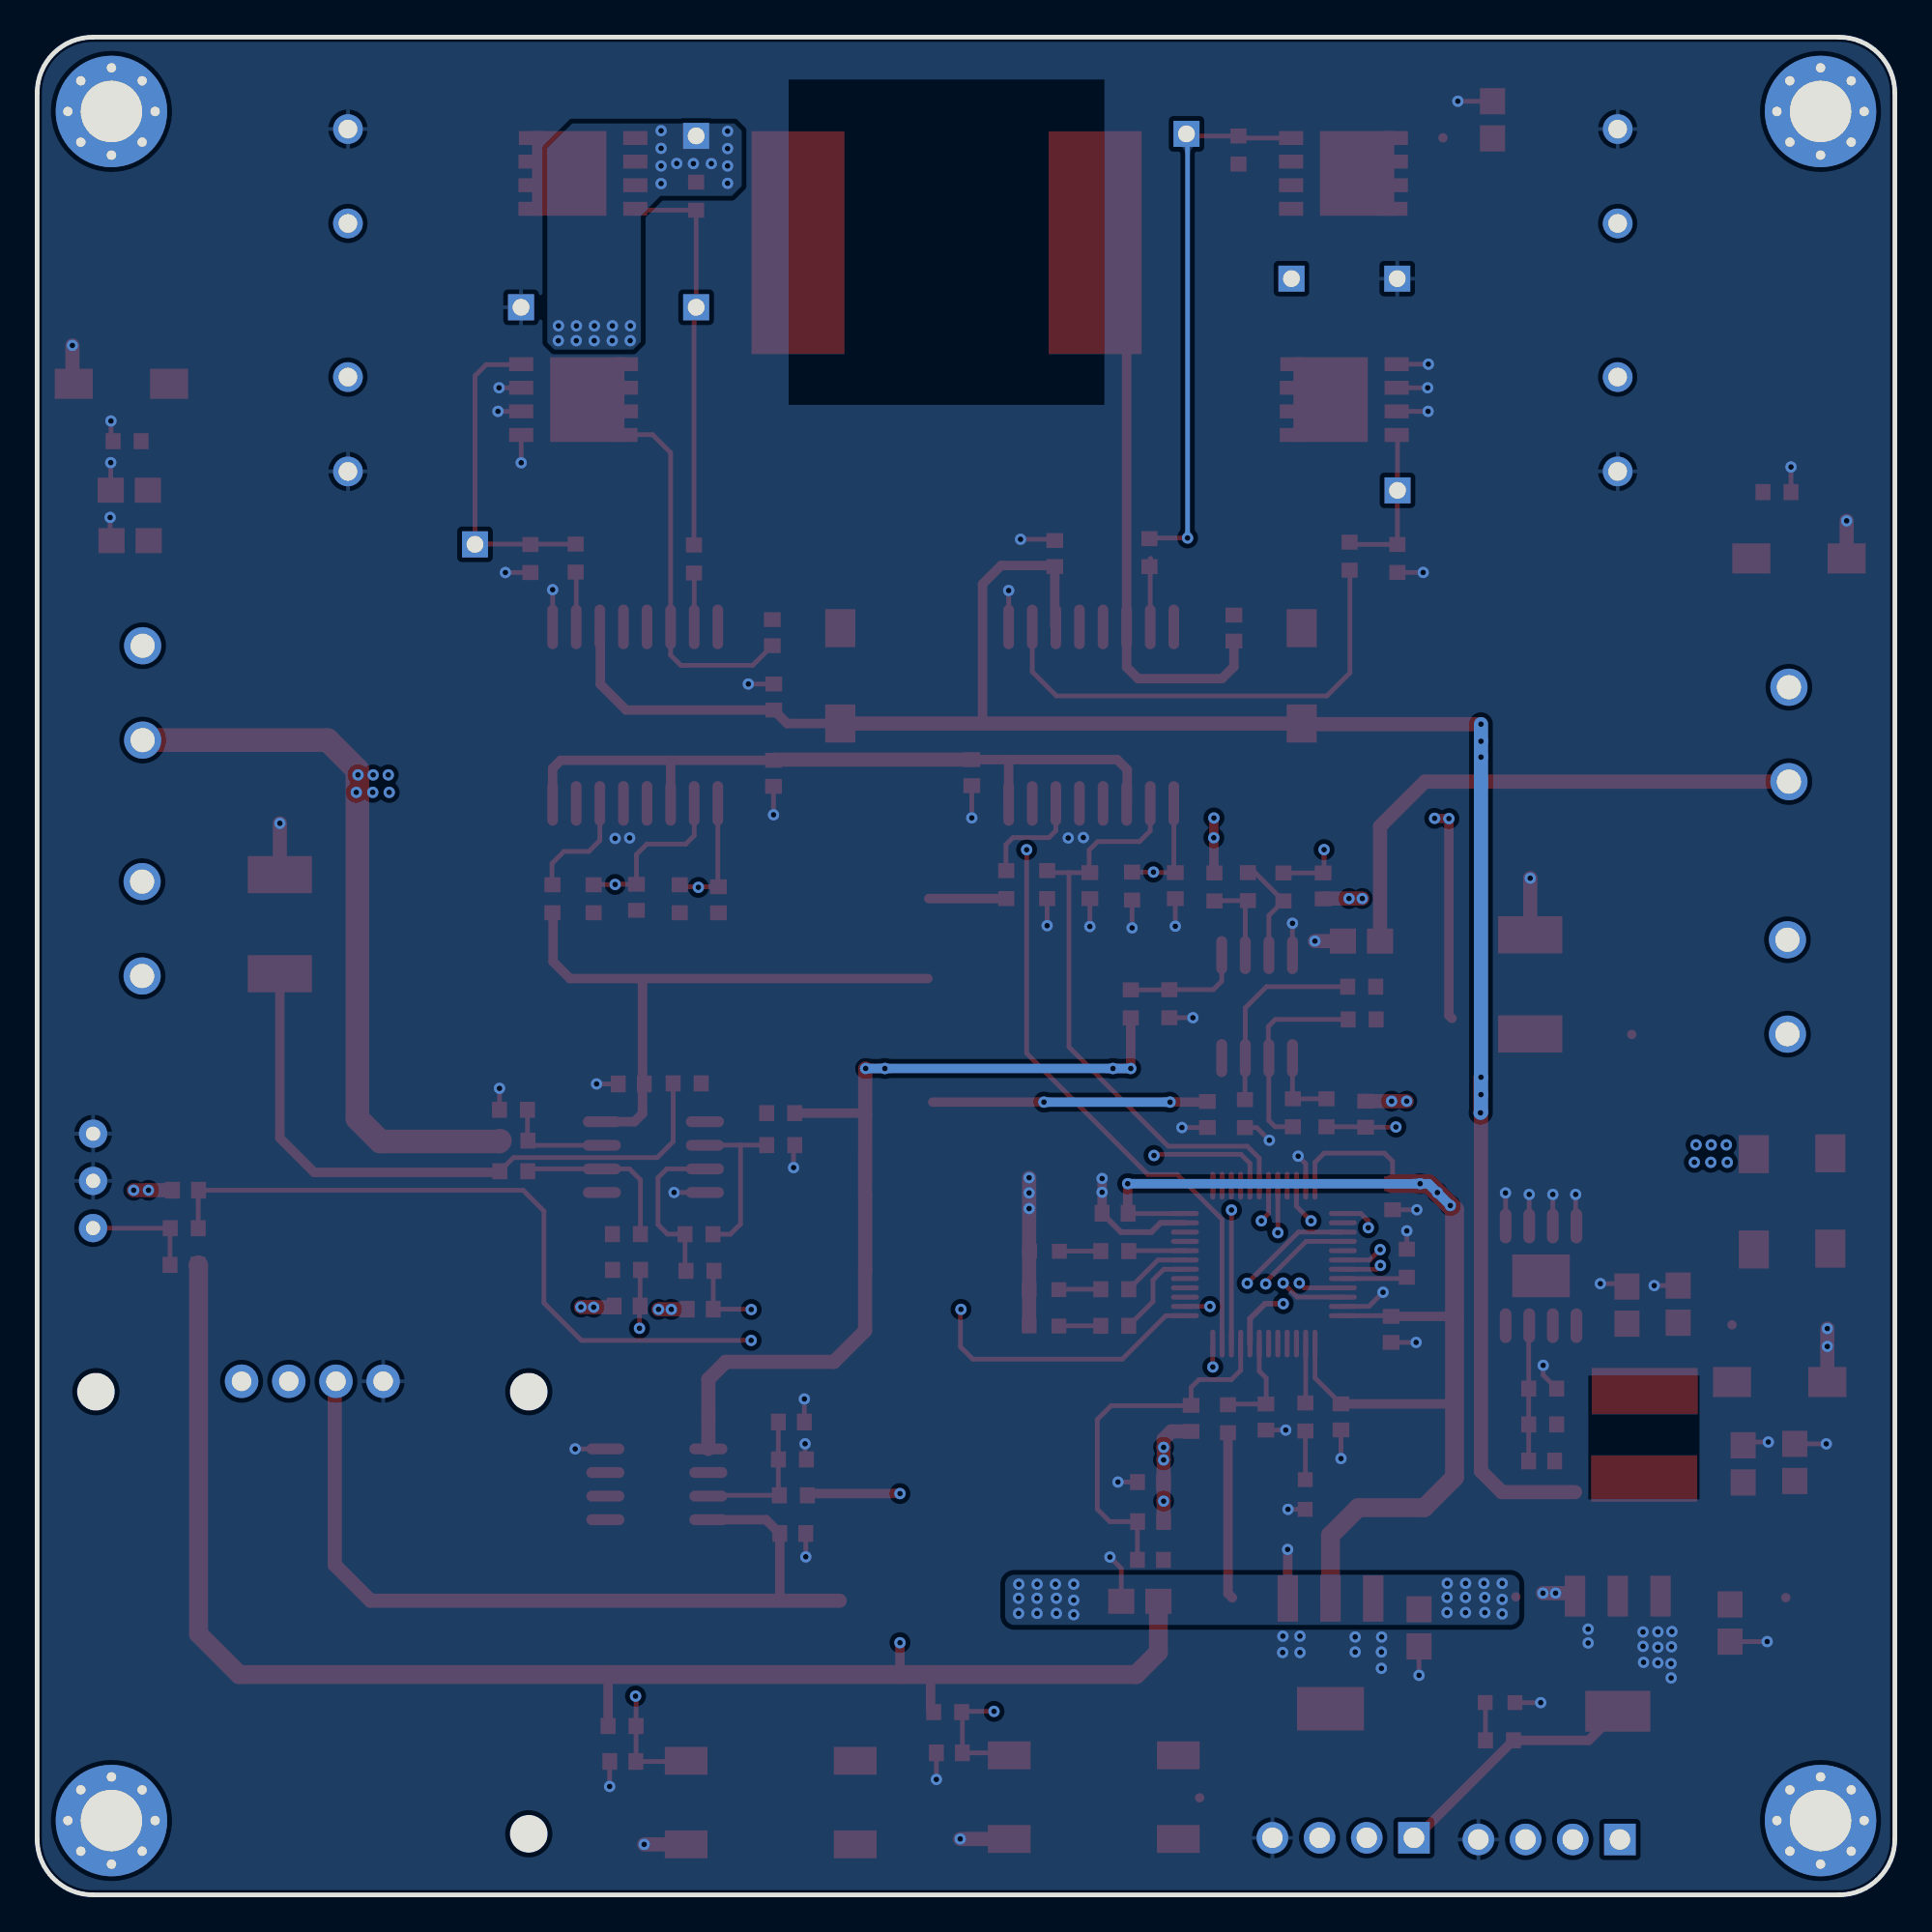
[diagram p4: board, bottom side, seen from below]

Outline 100 x 100 mm; copper layers: Top Layer, Inner1, Inner2, Bottom Layer. Coordinates in mm from the lower left corner of the outline.
Outline path: 0,97 0,3 arc(0.88,0.88) 3,0 97,0 arc(99.12,0.88) 100,3 100,97 arc(99.12,99.12) 97,100 3,100 arc(0.88,99.12) 0,97
Stack: Top Layer 0.035mm Outer layer thickness 1oz / Dielectric1 0.2104mm 7628 RC49% 8.6mil / Inner1 0.0152mm Inner layer thickness / Dielectric2 1.065mm 1.1mm H/HOZ Copper / Inner2 0.0152mm Inner layer thickness / Dielectric3 0.2104mm 7628 RC49% 8.6mil / Bottom Layer 0.035mm Outer layer thickness 1oz

## Design rules (mm)
spacing copperThickness1oz (default): track to track 0.102, other pairs 0.152 to 0.3
spacing copperThickness2oz: track to track 0.203, other pairs 0.152 to 0.3
track width copperThickness1oz (default): min 0.127, default 0.254, max 2.54
track width copperThickness2oz: min 0.203, default 0.254, max 2.54
track width POWER: min 0.254, default 0.508, max 2.54
differential pair differentialPair (default): width min 0.127, default 0.254, max 2.54; gap min 0.152, default 0.152
net +12V uses POWER
net +5V uses POWER
net 3V3 uses POWER
net 1V65 uses POWER
net AGND uses copperRegion
net GND uses copperRegion

## Placement (name value [footprint] x y rotation side)
C1  10uF  [C0805]  14.42 31.74 270 top
C2  10uF  [C0805]  11.66 31.8 270 top
C3  330pF 0603 5% 50V  [C0603]  19.01 23.35 180 top
C4  10uF  [C0805]  5.39 23.28 270 top
C5  10uF  [C0805]  8.17 23.2 270 top
C6  10uF  [C0805]  8.87 14.63 90 top
C7  10uF  [C0805]  25.61 14.37 90 top
C8  10uF  [C0805]  40.64 15.8 180 top
C9  470nF  [C0603]  40.06 20.09 0 top
C10  470nF  [C0603]  33.86 25.72 90 top
C11  470nF  [C0603]  37.88 25.65 270 top
C12  470nF  [C0603]  29.82 25.73 90 top
C13  470nF  [C0603]  41.97 36.69 180 top
C14  470nF  [C0603]  27.04 37.58 90 top
C15  470nF  [C0603]  27.12 30.44 90 top
C16  100nF  [C0603]  68.47 7.18 180 top
C17  100nF  [C0603]  50.89 7.64 180 top
C18  10uF  [C0805]  21.66 95.55 270 top
C19  10uF  [C0805]  28.71 51.34 180 top
C20  220uF  [CAP-TH_BD10.0-P5.00-D1.0-FD]  14.92 79.16 270 top
C21  220uF  [CAP-TH_BD10.0-P5.00-D1.0-FD]  14.92 92.51 90 top
C22  220uF  [CAP-TH_BD10.0-P5.00-D1.0-FD]  83.27 92.51 90 top
C23  220uF  [CAP-TH_BD10.0-P5.00-D1.0-FD]  83.27 79.16 270 top
C24  10uF  [C0805]  95.04 75.61 180 top
C25  10uF  [C0805]  95 72.9 180 top
C26  330pF  [C0603]  38.73 54.33 270 top
C27  330pF  [C0603]  43.33 54.33 270 top
C28  470nF  [C0603]  49.69 60.41 90 top
C29  100nF  [C0603]  35.58 68.19 270 top
C30  470nF  [C0603]  45.22 72.2 90 top
C31  330pF  [C0603]  63.32 53.56 270 top
C32  330pF  [C0603]  67.74 53.7 270 top
C33  470nF  [C0603]  60.36 60.37 90 top
C34  100nF  [C0603]  60.43 67.94 270 top
C35  470nF  [C0603]  60.35 64.48 90 top
C36  470nF  [C0603]  37.01 42.01 270 top
C37  330pF  [C0603]  28.49 42.02 270 top
C38  330pF  [C0603]  30.78 54.31 90 top
C39  470nF  [C0603]  68.02 43.65 0 top
C40  330pF  [C0603]  68.24 31.7 180 top
C41  330pF  [C0603]  64.31 31.53 180 top
C42  470nF  [C0603]  59.4 25.45 0 top
C43  470nF  [C0603]  59.32 19.45 180 top
C44  470nF  [C0603]  92.01 37.93 180 top
D1  SS210  [SMA_L4.4-W2.8-LS5.4-RD]  7.59 37.31 90 top
D2  SS210  [SMA_L4.4-W2.8-LS5.4-RD]  3.47 37.35 90 top
D3  SS210  [SMA_L4.4-W2.8-LS5.4-RD]  6.2 27.61 180 top
D4  SS210  [SMA_L4.4-W2.8-LS5.4-RD]  5.16 71.94 180 top
D5  SS210  [SMA_L4.4-W2.8-LS5.4-RD]  95.46 81.34 0 top
D6  SS210  [SMA_L4.4-W2.8-LS5.4-RD]  31.93 65.62 270 top
D7  SS210  [SMA_L4.4-W2.8-LS5.4-RD]  56.77 65.62 270 top
H1  -  [HDR-TH_4P-P2.54-V-M]  18.61 2.98 0 top
H2  -  [HDR-TH_4P-P2.54-V-M]  29.7 3.07 0 top
H3  -  [HDR-TH_1P-V-M_XKB_X4611WV-01I-C28D40]  32.48 87 0 top
H4  -  [HDR-TH_1P-V-M_XKB_X4611WV-01I-C28D40]  38.13 94.79 0 top
H7  -  [HDR-TH_1P-V-M_XKB_X4611WV-01I-C28D40]  26.77 75.6 0 top
H8  -  [HDR-TH_1P-V-M_XKB_X4611WV-01I-C28D40]  26.79 87 0 top
H9  -  [HDR-TH_1P-V-M_XKB_X4611WV-01I-C28D40]  64.53 94.68 0 top
H10  -  [HDR-TH_1P-V-M_XKB_X4611WV-01I-C28D40]  64.53 85.46 0 top
H11  -  [HDR-TH_1P-V-M_XKB_X4611WV-01I-C28D40]  76.43 72.7 0 top
H12  -  [HDR-TH_1P-V-M_XKB_X4611WV-01I-C28D40]  73.95 85.46 0 top
L1  100uH  [IND-SMD_L6.0-W6.0_FNR60XXS]  13.48 24.76 270 top
L2  10uH  [L0603]  40.07 18.03 0 top
L3  10uH  [L0603]  40.07 22.22 180 top
L4  22uH  [IND-SMD_L17.5-W17.0_YXMAC1770]  51.05 88.94 0 top
LED1  -  [LED_0603]  21.3 10.36 0 top
LED2  -  [LED_0603]  45.72 34.64 180 top
LED3  -  [LED_0603]  45.75 32.57 180 top
LED4  -  [LED_0603]  45.75 30.61 180 top
LED5  -  [LED_0603]  31.73 21.6 90 top
M1  M3螺丝  [螺钉孔]  4 4 0 top
M2  M3螺丝  [螺钉孔]  96 4 0 top
M3  M3螺丝  [螺钉孔]  96 96 0 top
M4  M3螺丝  [螺钉孔]  4 96 0 top
P1  WJ500V-5.08-2P  [CONN-TH_2P-P5.00_WJ500V-5.08-2P]  5.7 62.47 90 top
P2  WJ500V-5.08-2P  [CONN-TH_2P-P5.00_WJ500V-5.08-2P]  5.78 48.87 90 top
P3  WJ500V-5.08-2P  [CONN-TH_2P-P5.00_WJ500V-5.08-2P]  94.32 64.7 270 top
P4  WJ500V-5.08-2P  [CONN-TH_2P-P5.00_WJ500V-5.08-2P]  94.35 52 270 top
Q1  BSC070N10NS3G  [PG-TDSON-8_L5.0-W6.0-P1.27-BL-EP]  29.68 92.66 90 top
Q2  BSC070N10NS3G  [PG-TDSON-8_L5.0-W6.0-P1.27-BL-EP]  29.64 80.49 270 top
Q3  BSC070N10NS3G  [PG-TDSON-8_L5.0-W6.0-P1.27-BL-EP]  70.62 92.66 270 top
Q4  BSC070N10NS3G  [PG-TDSON-8_L5.0-W6.0-P1.27-BL-EP]  71.12 80.49 90 top
R1  13K 0.1%  [R0603]  18.96 25.32 180 top
R2  1.5K 0.1%  [R0603]  18.96 27.25 0 top
R3  3.3K  [R0603]  21.28 8.32 180 top
R4  10K  [R0603]  35.9 25.63 90 top
R5  1K  [R0603]  26.27 34 90 top
R6  3.3K  [R0603]  41.99 34.65 180 top
R7  3.3K  [R0603]  41.99 32.6 180 top
R8  3.3K  [R0603]  41.99 30.63 180 top
R9  3.3K  [R0603]  31.73 25.72 90 top
R10  10K  [R0603]  68.51 9.09 0 top
R11  10K  [R0603]  50.99 9.84 0 top
R12  10K  [R0603]  6.34 75.51 0 top
R14  1mΩ  [RES-SMD_L6.3-W3.2_R2512]  19.63 49.01 90 top
R15  10K  [R0603]  26.78 71.94 90 top
R16  10K  [R0603]  35.33 93.92 270 top
R17  10K  [R0603]  64.53 91.44 270 top
R18  10K  [R0603]  73.45 71.93 270 top
R19  10K  [R0603]  95.16 78.25 180 top
R20  1mΩ  [RES-SMD_L6.3-W3.2_R2512]  86.94 52.25 270 top
R21  10K  [R0603]  41.06 54.3 270 top
R22  10K  [R0603]  45.63 54.38 270 top
R23  3.3K  [R0603]  47.83 54.38 90 top
R24  10Ω  [R0603]  40.13 72.25 90 top
R25  10Ω  [R0603]  29.35 72.06 90 top
R26  10K  [R0603]  65.41 53.62 270 top
R27  10K  [R0603]  70.05 53.62 270 top
R28  3.3K  [R0603]  72.26 53.62 90 top
R29  10Ω  [R0603]  64.64 71.91 90 top
R30  10Ω  [R0603]  71.01 71.96 90 top
R31  3.3K  [R0603]  34.98 42.06 270 top
R32  3.3K  [R0603]  32.4 42.1 270 top
R33  68K  [R0603]  28.7 48.89 0 top
R34  68K  [R0603]  28.67 47.12 0 top
R35  100  [R0603]  30.6 42.1 270 top
R36  100  [R0603]  39.05 47.97 90 top
R37  100  [R0603]  36.63 54.25 270 top
R38  100  [R0603]  32.91 54.25 90 top
R39  15K  [R0603]  41.13 47.96 270 top
R40  15K  [R0603]  34.82 54.27 270 top
R41  3.3K  [R0603]  74.36 42.26 0 top
R42  3.3K  [R0603]  68.28 35.57 180 top
R43  68K  [R0603]  74.33 40.6 180 top
R44  68K  [R0603]  74.34 38.95 180 top
R45  100  [R0603]  68.27 33.64 180 top
R46  100  [R0603]  65.01 43.68 180 top
R47  100  [R0603]  59.97 40.36 0 top
R48  100  [R0603]  64.32 33.59 180 top
R49  15K  [R0603]  59.98 42.08 180 top
R50  15K  [R0603]  64.37 35.56 180 top
R51  3.3K  [R0603]  59.29 21.5 0 top
R52  3.3K  [R0603]  59.35 23.44 0 top
R53  10K 1%  [R0603]  92.09 33.91 0 top
R54  50kΩ  [RES-ADJ-TH_3296W]  96.99 38.43 0 top
R55  3.3K 1%  [R0603]  92.08 35.88 180 top
SW1  KH-6X6X5H-STM  [SW-SMD_4P-L6.0-W6.0-P4.50-LS9.0_H5.0]  60.52 4.97 180 top
SW2  KH-6X6X5H-STM  [SW-SMD_4P-L6.0-W6.0-P4.50-LS9.0_H5.0]  43.12 5.26 180 top
TP1  -  [Test-Point-0.5mm]  5.87 16 0 top
TP2  -  [Test-Point-0.5mm]  20.4 16.04 0 top
TP3  -  [Test-Point-0.5mm]  35.67 16 0 top
TP4  -  [Test-Point-0.5mm]  8.77 30.68 0 top
TP5  -  [Test-Point-0.5mm]  37.42 5.22 0 top
TP6  -  [Test-Point-0.5mm]  24.33 94.58 0 top
TP7  -  [Test-Point-0.5mm]  14.16 46.32 0 top
TP10  -  [Test-Point-0.5mm]  63.87 25.83 0 top
U1  XL7005A  [SOIC-8_L4.9-W3.9-P1.27-LS6.0-BL-EP3.1-1]  19.05 33.32 0 top
U2  AMS1117-5.0  [SOT-223_L6.7-W3.5-P2.30-BR]  14.91 12.98 90 top
U3  AMS1117-3.3  [SOT-223-3_L6.5-W3.4-P2.30-LS7.0-BR]  30.38 12.99 90 top
U4  STM32F334C8T6  [LQFP-48_L7.0-W7.0-P0.50-LS9.0-BL]  33.96 33.93 0 top
U5  HS96L03W2C03  [OLED-TH_L27.8-W27.2-P2.54_C9900033791]  85.19 27.65 0 top
U6  SI8233BD-D-ISR  [SOIC-16_L10.3-W7.5-P1.27-LS10.3-BL]  43.26 63.5 0 top
U7  SI8233BD-D-ISR  [SOIC-16_L10.3-W7.5-P1.27-LS10.3-BL]  67.81 63.5 0 top
U8  GS8552-SR  [SOIC-8_L4.9-W3.9-P1.27-LS6.0-BL]  34.33 47.81 0 top
U9  GS8552-SR  [SOIC-8_L4.9-W3.9-P1.27-LS6.0-BL]  66.83 39.71 90 top
U10  GS8552-SR  [SOIC-8_L4.9-W3.9-P1.27-LS6.0-BL]  66.64 22.1 270 top

## Footprints (pads in the part's own frame, mm; a bottom-side part is the same pattern mirrored in y, then rotated)
C0603
  rect 0.8x0.9 smd: 1(-0.7,0) 2(0.7,0)
C0805
  rect 1.41x1.35 smd: 1(-1,0) 2(1,0)
CAP-TH_BD10.0-P5.00-D1.0-FD
  round 1.6 hole 1: 1(-2.54,0) 2(2.54,0)
CONN-TH_2P-P5.00_WJ500V-5.08-2P
  round 2 hole 1.3: 1(-2.54,0) 2(2.54,0)
HDR-TH_1P-V-M_XKB_X4611WV-01I-C28D40
  rect 1.4x1.4 hole 0.9: 1(0,0)
HDR-TH_4P-P2.54-V-M
  rect 1.7x1.7 hole 1.1: 1(-3.81,0)
  round 1.7 hole 1.1: 2(-1.27,0) 3(1.27,0) 4(3.81,0)
IND-SMD_L6.0-W6.0_FNR60XXS
  rect 2.5x5.7 smd: 1(-2.35,-0.013) 2(2.35,0.013)
IND-SMD_L17.5-W17.0_YXMAC1770
  rect 5x12 smd: 1(-8,0) 2(8,0)
L0603
  rect 0.8x0.864 smd: 1(-0.7,0) 2(0.7,0)
LED_0603
  rect 0.8x0.8 smd: 1(-0.851,-0.01) 2(0.75,-0.005)
LQFP-48_L7.0-W7.0-P0.50-LS9.0-BL
  oval 0.27x1.5 smd: 1(-2.75,-4.25) 2(-2.25,-4.25) 3(-1.75,-4.25) 4(-1.25,-4.25) 5(-0.75,-4.25) 6(-0.25,-4.25) 7(0.25,-4.25) 8(0.75,-4.25) 9(1.25,-4.25) 10(1.75,-4.25) 11(2.25,-4.25) 12(2.75,-4.25) 25(2.75,4.25) 26(2.25,4.25) 27(1.75,4.25) 28(1.25,4.25) 29(0.75,4.25) 30(0.25,4.25) 31(-0.25,4.25) 32(-0.75,4.25) 33(-1.25,4.25) 34(-1.75,4.25) 35(-2.25,4.25) 36(-2.75,4.25)
  oval 1.5x0.27 smd: 13(4.25,-2.75) 14(4.25,-2.25) 15(4.25,-1.75) 16(4.25,-1.25) 17(4.25,-0.75) 18(4.25,-0.25) 19(4.25,0.25) 20(4.25,0.75) 21(4.25,1.25) 22(4.25,1.75) 23(4.25,2.25) 24(4.25,2.75) 37(-4.25,2.75) 38(-4.25,2.25) 39(-4.25,1.75) 40(-4.25,1.25) 41(-4.25,0.75) 42(-4.25,0.25) 43(-4.25,-0.25) 44(-4.25,-0.75) 45(-4.25,-1.25) 46(-4.25,-1.75) 47(-4.25,-2.25) 48(-4.25,-2.75)
OLED-TH_L27.8-W27.2-P2.54_C9900033791
  round 1.8 hole 1.05: 1(-3.81,0) 2(-1.27,0) 3(1.27,0) 4(3.81,0)
PG-TDSON-8_L5.0-W6.0-P1.27-BL-EP
  rect 0.75x1.3 smd: 1(-1.905,-2.82) 2(-0.635,-2.82) 3(0.635,-2.82) 4(1.905,-2.82) 5(1.905,2.82) 6(0.635,2.82) 7(-0.635,2.82) 8(-1.905,2.794)
  rect 4.56x4 smd: 8(0,0.737)
R0603
  rect 0.806x0.864 smd: 1(-0.753,0) 2(0.753,0)
RES-ADJ-TH_3296W
  round 1.524 hole 0.762: 1(0,2.54) 2(0,0) 3(0,-2.54)
RES-SMD_L6.3-W3.2_R2512
  rect 2x3.456 smd: 1(-2.667,0) 2(2.667,0)
SMA_L4.4-W2.8-LS5.4-RD
  rect 2.046x1.62 smd: 1(-2.566,0) 2(2.566,0)
SOIC-8_L4.9-W3.9-P1.27-LS6.0-BL
  oval 0.588x2.045 smd: 1(-1.905,-2.772) 2(-0.635,-2.772) 3(0.635,-2.772) 4(1.905,-2.772) 5(1.905,2.772) 6(0.635,2.772) 7(-0.635,2.772) 8(-1.905,2.772)
SOIC-8_L4.9-W3.9-P1.27-LS6.0-BL-EP3.1-1
  oval 0.63x1.865 smd: 1(-1.905,-2.683) 2(-0.635,-2.683) 3(0.635,-2.683) 4(1.905,-2.683) 5(1.905,2.683) 6(0.635,2.683) 7(-0.635,2.683) 8(-1.905,2.683)
  rect 3.1x2.3 smd: 9(0,0)
SOIC-16_L10.3-W7.5-P1.27-LS10.3-BL
  oval 0.574x2.401 smd: 1(-4.445,-4.75) 2(-3.175,-4.75) 3(-1.905,-4.75) 4(-0.635,-4.75) 5(0.635,-4.75) 6(1.905,-4.75) 7(3.175,-4.75) 8(4.445,-4.75) 9(4.445,4.75) 10(3.175,4.75) 11(1.905,4.75) 12(0.635,4.75) 13(-0.635,4.75) 14(-1.905,4.75) 15(-3.175,4.75) 16(-4.445,4.75)
SOT-223-3_L6.5-W3.4-P2.30-LS7.0-BR
  rect 2.5x1.1 smd: 1(2.97,-2.3) 2(2.97,0) 3(2.97,2.3)
  rect 2.34x3.6 smd: 4(-2.97,0)
SOT-223_L6.7-W3.5-P2.30-BR
  rect 2.2x1.1 smd: 1(3.099,-2.3) 2(3.099,0) 3(3.099,2.3)
  rect 2.2x3.5 smd: 4(-3.099,0)
SW-SMD_4P-L6.0-W6.0-P4.50-LS9.0_H5.0
  rect 2.3x1.5 smd: 1(-4.55,2.25) 2(4.55,2.25) 3(-4.55,-2.25) 4(4.55,-2.25)
Test-Point-0.5mm
  round 0.5 smd: 1(0,0)
螺钉孔
  round 1.001 hole 0.5: 1(-2.349,0) 1(-1.651,1.651) 1(-1.651,-1.651) 1(0,2.349) 1(0,-2.349) 1(1.651,1.651) 1(1.651,-1.651) 1(2.349,0)
  round 6 hole 3.302: 1(0,0)

## Nets
As in the schematic.

Pads without a net: M1 1; M2 1; M3 1; M4 1; SW1 2 4; SW2 2 4; U1 4; U4 3 4 5 6 15 16 17 21 22 25 26 27 28 33 38 41; U6 7 12 13; U7 7 12 13; U10 5 6 7

## Via types
v1: diameter 0.61, hole 0.305, Top Layer to Bottom Layer, 221 vias

## Routing (per net, layer and track width the routed paths; a pad name or vN(x,y) marks a point on that pad's centre or on a via; arc(x,y) is an arc through that point)
1V65: length 50.2
  Top Layer w0.508: v1(42.09,44.48) v1(41.13,44.48) R39.2 ; R49.2 55.49,42.08 55.43,42.01 ; v1(55.4,44.48) v1(54.37,44.48)
  Top Layer w0.762: U10.1 TP10.1 63.87,27.76 62.93,28.69 57.11,28.69 55.43,30.37 55.43,33.61 55.42,33.62 55.42,37.66 ; v1(55.4,44.48) 55.43,44.46 55.43,42.01 55.43,37.66
  Bottom Layer w0.508: v1(55.4,44.48) v1(54.37,44.48) v1(42.09,44.48) v1(41.13,44.48)
3V3: length 179.4
  Top Layer w0.254: U4.1 31.21,27.83 C12.2 ; C14.2 27.04,39.49 27.48,39.93 30.72,39.93 31.21,39.43 U4.36 ; C15.2 27.15,31.18 U4.48 ; U4.24 40.93,36.68
  Top Layer w0.508: R51.1 58.44,21.6 v1(53.55,21.6) ; 51.91,11.86 51.91,10 R11.2 ; R4.1 35.9,16.23 TP3.1 ; C13.2 41.3,36.71 v1(41.3,38.28) ; v1(53.55,13.57) 53.55,11.69 ; 69.27,11.86 R10.2 ; C15.2 23.65,31.14 23.6,31.1 ; C12.2 23.77,26.43
  Top Layer w1.016: R53.1 91.31,33.88 91.31,14.04 89.13,11.86 40.85,11.86 39.64,13.06 C8.2 ; C14.2 v1(25.56,38.28) 25.1,38.28 v1(24.63,37.8) v1(23.93,37.11) 23.7,36.88 23.7,22.47 25.33,20.84 28.89,20.84 30.38,19.35 U3.2
  Inner2 w0.508: v1(53.55,21.6) v1(53.55,13.57)
  Bottom Layer w0.508: v1(41.3,38.28) v1(25.56,38.28) 25.1,38.28 v1(24.63,37.8) v1(23.93,37.11)
+5V: length 150.5
  Top Layer w0.508: 52.05,49.33 71.32,49.33 72.23,50.24 72.23,52.83 72.26,52.87 ; H2.1 25.78,3.07 R3.2 16.48,8.32 U2.4 ; U7.3 65.9,61.07 65.9,61.07 ; 60.02,16.21 60.02,19.45 60.77,20.19 U10.4 ; 47.78,61.11 41.86,61.11 41.32,60.57 41.32,58.78 U6.3 ; 47.78,61.11 47.7,61.04 U6.8 ; 47.78,61.11 C28.2 ; 65.9,61.07 71.82,61.07 72.25,60.64 U7.8 ; 65.9,61.07 C33.2 ; v1(39.01,42.67) 37.04,42.67 C36.1 ; U9.4 67.85,41.62 67.41,42.06 67.41,49.17 ; R23.1 52.01,53.63 ; 51.79,42.67 v1(45.81,42.67)
  Top Layer w0.762: C33.2 60.32,61.11 C28.2 ; 56.8,15.83 82.05,15.83 83.98,17.76 83.98,27.58 83.92,27.65
  Bottom Layer w0.508: v1(45.81,42.67) v1(39.01,42.67)
  vias: v1(21.14,16.77) v1(21.14,15.91) v1(21.14,15.12) v1(22.07,16.01) v1(22.07,15.2) v1(22.12,16.77) v1(23.11,16.77) v1(23.11,16.01) v1(23.11,15.2) v1(24.09,16.77) v1(24.1,16.01) v1(24.1,15.2) v1(44.2,16.72) v1(44.2,15.86) v1(44.2,15.08) v1(45.19,16.72) v1(45.14,15.97) v1(45.14,15.15) v1(46.17,16.72) v1(46.18,15.97) v1(46.18,15.15) v1(47.16,16.72) v1(47.17,15.97) v1(47.17,15.15)
+12V: length 117.7
  Top Layer w0.508: D7.2 59.63,63.05 C35.1 68.29,63.78 69.68,65.17 69.68,68.23 U7.11 ; U6.11 45.22,68.31 C30.1 45.27,71.56 48.11,71.56 49.11,70.56 49.11,63.18
  Top Layer w0.762: v1(22.31,42.1) 22.31,43.98 v1(22.28,44.01) v1(22.28,43.08) 22.28,22.81 21.15,21.68 17.22,21.68 ; D7.2 D6.2 31.89,63.02 v1(22.28,63.02) v1(22.28,62.1) v1(22.28,61.25)
  Bottom Layer w0.762: v1(22.31,42.1) 22.28,42.12 v1(22.28,43.08) v1(22.28,44.01) v1(22.28,61.25) v1(22.28,62.1) v1(22.28,63.02)
A3V3: length 20.2
  Top Layer w0.254: L2.2 40.77,20.08 C9.2 42.26,20.09 42.93,20.76 42.93,25.59 42.19,26.33 37.9,26.33 C11.1 37.88,27.31 37.46,27.74 35.72,27.74 35.21,28.24 U4.9
AGND: length 19.3
  Top Layer w0.254: C38.1 30.76,53.63
  Top Layer w0.305: U4.8 34.71,31.01 33.9,31.82 v1(32.92,31.82)
  Top Layer w0.508: v1(70.04,31.63) 70.05,31.64 ; C40.1 69.01,31.63 ; C41.1 65.02,31.52
  Top Layer w0.762: C11.2 38.94,24.95 39.36,24.53 v1(39.36,24.09) v1(39.36,23.41) v1(39.36,21.19) C9.1 ; C44.1 v1(94.01,37.93) v1(94.8,37.93) ; 30.76,53.63 v1(29.38,53.63) v1(28.67,53.63) ; 70.05,31.64 v1(70.73,31.64) ; 65.02,31.52 v1(65.86,31.52) v1(66.55,31.52) ; v1(26.28,42.72) v1(27.09,42.72) C37.1 ; 69.01,31.63 v1(70.04,31.63)
GND: length 127.3
  Top Layer w0.254: C10.1 v1(32.79,25.02) ; R12.1 v1(5.59,76.86) ; C42.1 v1(58.7,26.69) ; C28.1 v1(49.69,57.97) ; C17.1 v1(51.59,6.21) ; v1(59.28,39.15) 59.28,40.3 R47.1 ; R19.1 96.03,78.36 v1(96.03,79.34) ; v1(17.18,37.7) 17.18,36.04 U1.8 ; L3.1 v1(41.82,22.22) ; C7.1 v1(25.61,11.82) ; v1(27.55,32.44) 28.31,31.68 U4.47 ; C33.1 v1(60.36,58.14) ; R18.2 v1(74.79,71.18) ; R31.2 34.36,41.3 v1(33.67,40.62) ; v1(15.85,32.9) 14.58,32.9 C1.1 ; U7.9 v1(72.25,70.26) ; R15.1 v1(25.39,71.19) ; 18.41,36 18.41,37.77 ; Q2.3 v1(25.13,79.86) ; R2.1 18.93,27.98 v1(18.93,28.5) ; U9.8 v1(65.72,37.81) ; C14.1 v1(25.73,36.88) ; R52.1 58.66,23.51 v1(58.66,24.28) ; U6.9 v1(47.7,70.21) ; U1.5 20.95,37.61 20.85,37.71 20.88,37.71 v1(20.96,37.78) ; v1(32.12,39.76) 31.71,39.36 U4.35 ; C4.1 v1(3.69,24.28) ; C25.1 96.07,72.97 v1(96.07,74.14) ; U1.6 19.68,37.77 ; C5.1 7.99,24.38 v1(6.81,24.38) ; C36.2 v1(38.38,41.31) ; R22.2 v1(45.63,52.17) ; C39.2 v1(69.89,43.65) ; Q4.3 v1(75.14,81.13) ; v1(42.25,18.18) 41.64,17.57 C8.1 ; C2.1 v1(12.95,32.8) ; Q4.1 v1(73.94,77.09) ; U8.8 v1(32.43,52.3) ; R5.2 v1(26.27,35.74) ; LED1.1 v1(19.06,10.35) ; U10.8 v1(71.04,24) ; C15.1 v1(25.77,29.74) ; C27.2 v1(43.33,52.13) ; R36.1 v1(37.79,47.22) ; C12.1 v1(29.82,23.49) ; 8.87,13.63 v1(6.87,13.63) ; Q2.2 v1(25.15,81.13) ; Q4.2 v1(75.2,79.86) ; v1(69.18,5.84) 69.18,7.17 C16.1 ; 75.11,42.26 v1(75.11,43.41) ; C43.2 v1(58.62,18.19) ; C18.1 v1(23.52,96.55) ; C24.1 v1(96.04,77.1) ; R21.2 v1(41.06,52.05) ; C35.2 v1(61.72,65.18) ; C26.2 v1(38.73,52.14) ; Q2.1 v1(25.11,82.4) ; 45.4,72.97 v1(47.07,72.97) ; LED5.1 v1(32.67,20.75)
  Top Layer w0.305: U4.23 39.52,36.18 40.03,35.67 41.66,35.67 C13.1
  Top Layer w0.508: v1(42.67,38.56) v1(42.67,37.82) C13.1 ; v1(32.69,18.59) 32.68,18.59 U3.1
  Top Layer w0.762: v1(19.63,54.72) 19.63,54.72 R14.2 ; LED4.1 46.6,34.62 ; D3.2 v1(3.63,29.52) v1(3.63,30.48) ; SW2.1 v1(50.31,3.01) ; R20.1 v1(86.94,57.68) ; U2.1 17.37,16.24 v1(18.26,16.24) v1(18.94,16.24) ; 46.6,34.62 LED2.1 ; 46.6,34.62 v1(46.6,36.94) v1(46.6,37.78) v1(46.6,38.6) ; SW1.1 v1(67.32,2.72) ; D5.2 98.1,81.41 v1(98.1,83.41) ; C19.1 v1(31.22,51.34) ; D4.2 v1(2.59,73.96)
  vias: v1(12,14.17) v1(12.02,13.35) v1(12.05,12.45) v1(12.04,11.68) v1(12.76,14.16) v1(12.76,13.33) v1(12.76,12.49) v1(13.56,14.15) v1(13.56,13.38) v1(13.53,12.52) v1(16.51,14.3) v1(16.51,13.56) v1(18.41,37.7) v1(19.68,37.7) v1(27.63,13.88) v1(27.64,13.07) v1(27.64,12.19) v1(29.05,13.88) v1(29.05,13.07) v1(32.02,13.93) v1(32.02,13.04) v1(32.94,13.93) v1(32.95,13.04) v1(43.68,56.91) v1(44.5,56.89) v1(68.11,56.9) v1(68.89,56.87)
VIN+: length 29.2
  Top Layer w0.762: P1.1 25.3,59.92 27.71,57.51 C19.2
VIN-: length 28.3
  Top Layer w0.508: v1(24.77,57.95) 24.76,57.94 v1(24.01,57.94) 24.01,47.34 23.84,47.18 ; v1(36.66,57.97) 36.66,55.04 R37.1
  Inner2 w0.508: v1(24.01,57.94) 24.76,57.94 v1(24.77,57.95) 24.78,57.95 36.64,57.95 ; v1(36.66,56.9) 36.66,57.93 36.64,57.95 ; 36.64,57.95 v1(36.66,57.97)
ADC_IIN: length 51.3
  Top Layer w0.254: v1(46.74,56.26) 46.74,45.3 40.21,38.77 38.63,38.77 36.21,36.36 U4.11 ; v1(30.72,56.26) 30.72,55.06 C38.2 30.78,55.01 R38.2
  Inner2 w0.254: v1(30.72,56.26) 30.73,56.26 v1(46.74,56.26)
ADC_IOUT: length 30.8
  Top Layer w0.254: R48.2 63.61,33.55 C41.2 61.58,31.53 v1(61.56,31.51) ; U4.13 39.25,31.18 41.58,28.84 49.63,28.84 50.3,29.5 50.3,31.49 v1(50.27,31.52)
  Inner2 w0.254: v1(50.27,31.52) 50.29,31.52 50.3,31.51 v1(61.56,31.51)
ADC_VADJ: length 65.3
  Top Layer w0.254: v1(61.57,29.85) 70.7,29.85 72.72,31.87 72.72,36.81 73.84,37.93 C44.2 91.33,37.91 R55.2 ; U4.14 v1(36.87,31.68)
  Inner2 w0.254: v1(36.87,31.68) 36.87,30.96 37.98,29.85 v1(61.57,29.85)
ADC_VIN: length 23.7
  Top Layer w0.254: v1(26.86,41.33) 26.87,41.32 C37.2 28.51,41.34 R35.2 ; v1(35.71,36.87) 35.71,36.86 U4.10
  Inner2 w0.254: v1(26.86,41.33) 26.86,37.77 27.76,36.87 v1(35.71,36.87)
ADC_VOUT: length 37
  Top Layer w0.254: U4.12 v1(36.71,28.42) ; R45.2 67.54,33.62 C40.2 67.58,31.66 v1(67.58,30.5)
  Inner2 w0.254: v1(36.71,28.42) 67.02,28.42 67.58,28.97 v1(67.58,30.5)
GATE1_H: length 29.6
  Top Layer w0.254: R24.2 40.09,73.04 v1(38.07,73.04) ; Q1.4 35.22,94.57 R16.1 38.02,94.68 H4.1
  Bottom Layer w0.254: 38.13,94.79 38.07,94.73 v1(38.07,73.04)
GATE1_L: length 8.5
  Top Layer w0.254: 29.35,72.69 29.34,72.69 R15.2 26.78,75.47 26.77,75.47 26.77,78.54 Q2.4
GATE2_H: length 21.4
  Top Layer w0.254: R29.2 64.64,85.34 H10.1 64.53,90.69 R17.2 67.73,90.69 Q3.4
GATE2_L: length 17.2
  Top Layer w0.254: Q4.4 73.97,82.37 75.83,82.37 76.43,81.77 H11.1 76.42,72.71 R30.2
HS-1: length 31.2
  Top Layer w0.508: L4.1 41.35,87.24 U6.14 41.35,66.09 40.73,65.47 36.22,65.47 35.58,66.11 C29.2
HS-2: length 19.9
  Top Layer w0.254: C34.2 61.49,66.18 65.35,66.18 65.9,66.74 U7.14 65.9,77.63 66.87,78.6 68.31,78.6 Q4.8
  vias: v1(62.83,94.94) v1(62.83,94) v1(62.83,93.07) v1(62.83,92.13) v1(63.71,93.19) v1(64.68,93.19) v1(65.57,93.2) v1(66.41,94.96) v1(66.41,94.02) v1(66.41,93.07) v1(66.41,92.12) v1(68.07,84.46) v1(68.08,83.66) v1(69.04,84.46) v1(69.04,83.66) v1(70,84.46) v1(70.01,83.66) v1(70.97,84.46) v1(70.98,83.66) v1(71.94,84.46) v1(71.95,83.66)
I2C_SCL: length 65.6
  Top Layer w0.254: U4.45 31.8,32.68 v1(32.06,32.93)
  Inner2 w0.254: v1(32.06,32.93) 32.06,34.66 32.4,34.99 85.41,34.99 86.59,33.81 86.59,27.78 U5.3
I2C_SDA: length 71
  Top Layer w0.254: v1(32.93,32.93) 32.17,32.18 U4.46
  Inner2 w0.254: U5.4 89,25.85 88.15,25 78.21,25 76.91,26.31 76.91,33.15 75.62,34.44 33.29,34.44 32.93,34.08 v1(32.93,32.93)
KEY1: length 66.8
  Top Layer w0.254: SW1.3 65.1,7.18 C16.2 67.76,7.19 R10.1 67.76,10.67 v1(67.79,10.7) ; v1(34.86,32.92) 32.11,35.68 U4.39
  Inner2 w0.254: v1(67.79,10.7) 36.42,10.7 34.86,12.26 v1(34.86,32.92)
KEY2: length 48.5
  Top Layer w0.254: v1(33.87,32.89) 33.87,33 31.69,35.18 U4.40 ; SW2.3 47.81,7.64 C17.2 50.19,9.8 R11.1 50.19,9.88 v1(48.49,9.88)
  Inner2 w0.254: v1(33.87,32.89) 33.87,11.33 35.37,9.82 48.44,9.82 v1(48.49,9.88)
LED_G: length 5
  Top Layer w0.254: 41.24,30.63 39.93,31.94 39.93,33.09 39.35,33.68 U4.18
LED_R: length 3
  Top Layer w0.254: 41.24,34.65 41.21,34.68 U4.20
LED_Y: length 3.7
  Top Layer w0.254: 41.24,32.6 39.66,34.18 U4.19
PC13: length 3.2
  Top Layer w0.254: 31.73,26.48 31.71,26.5 U4.2
PWM1H: length 28
  Top Layer w0.254: v1(39.88,39.8) 39.82,39.86 35.2,39.86 34.71,39.37 U4.29 ; U6.1 38.81,55.11 C26.1 39.88,55.03 v1(39.91,55.06) R21.1
  Inner2 w0.254: v1(39.88,39.8) 39.91,39.83 v1(39.91,55.06)
PWM1L: length 32.4
  Top Layer w0.254: 44.45,55.03 C27.1 43.37,55.06 43.37,56.24 42.91,56.7 40.66,56.7 40.08,57.27 U6.2 ; 44.45,55.03 44.46,55.02 44.46,45.64 39.11,40.3 34.86,40.3 34.21,39.65 U4.30 ; 44.45,55.03 45.52,55.03 R22.1
PWM2H: length 56.7
  Top Layer w0.254: R26.1 65.3,54.26 C31.1 ; U4.31 33.71,36.67 v1(34.1,36.28) ; 63.09,54.26 63.07,54.28 63.3,54.28 C31.1 ; C31.1 63.36,54.3 U7.1
  Inner2 w0.254: v1(64.41,54.24) 64.41,37.13 63.55,36.28 v1(34.1,36.28)
PWML2: length 65.7
  Top Layer w0.254: U7.2 64.63,57.02 65.09,56.56 67.18,56.56 67.74,56 67.74,54.4 ; R27.1 70.03,54.39 v1(68.89,54.39) 68.88,54.4 C32.1 ; U4.32 33.21,35.65
  Inner2 w0.254: v1(68.89,54.39) 68.89,36.39 68.14,35.65 v1(33.21,35.65)
RX: length 39.9
  Top Layer w0.254: U4.43 27.9,33.68 v1(27.69,33.88)
  Inner2 w0.254: v1(27.69,33.88) 21.49,33.88 19.88,32.27 H1.3
SWCLK: length 34.8
  Top Layer w0.254: U4.37 28.74,36.68 28.34,36.28 v1(28.34,35.91)
  Inner2 w0.254: v1(28.34,35.91) 28.34,3.15 H2.2
SWDAT: length 35.6
  Top Layer w0.254: v1(31.43,36.28) 32.21,37.07 U4.34
  Inner2 w0.254: v1(31.43,36.28) 31.43,3.53 H2.3
TX: length 43.5
  Top Layer w0.254: v1(27.71,34.73) 28.27,34.18 U4.42
  Inner2 w0.254: H1.2 17.34,33.32 18.75,34.73 v1(27.71,34.73)
VOUT+: length 128.9
  Top Layer w1.27: P3.2 84.36,62.16 82.76,60.56 82.76,41.8 81.52,40.55 75.13,40.55 R43.1
  Inner2 w0.254: v1(81.91,60.29) v1(81.1,60.29)
  Inner2 w1.27: v1(9.89,40.37) 9.89,57.42 12.01,59.55 80.85,59.55
  vias: v1(9.07,40.37) v1(9.02,39.43) v1(9.91,39.43) v1(10.7,40.37) v1(10.79,39.43) v1(81.05,59.35) v1(81.93,59.35) v1(82.73,60.29) v1(82.82,59.35)
VOUT-: length 34.6
  Top Layer w0.254: R44.1 74.35,39.69 66.62,39.69 65.76,40.55 R46.1
  Top Layer w0.508: R44.1 75.15,38.89 85.08,38.89 86.94,40.74 R20.2
$1N12: length 7.3
  Top Layer w0.254: C3.1 19.71,30.61 U1.3
$1N21: length 2
  Top Layer w0.254: R3.1 22.04,10.34 22.05,10.35
$1N36: length 3.5
  Top Layer w0.254: U4.44 26.34,33.18 26.27,33.25
$1N39: length 5.5
  Top Layer w0.254: U4.7 34.21,28.19 33.84,27.81 33.84,26.44 C10.2 35.86,26.42 R4.2
$1N69: length 2.2
  Top Layer w0.254: LED2.2 44.97,34.65 R6.1
$1N71: length 2.3
  Top Layer w0.254: LED3.2 44.98,32.6 R7.1
$1N72: length 2.6
  Top Layer w0.254: R9.1 31.73,22.36 31.74,22.35
$1N76: length 2.3
  Top Layer w0.254: R8.1 44.99,30.63 LED4.2
$2N110: length 5.9
  Top Layer w0.254: U6.6 45.16,57.29 45.54,56.91 47.47,56.91 47.85,56.53 47.85,55.15 R23.2
$2N115: length 3.7
  Top Layer w0.254: 40.06,71.94 40.08,71.92 U6.15
$2N122: length 26.1
  Top Layer w0.254: R25.1 29.33,71.29 29.33,65.78 30.58,64.54 45.13,64.54 46.43,65.84 U6.10
$2N125: length 3
  Top Layer w0.254: U7.10 70.98,71.17 R30.1
$2N131: length 2.9
  Top Layer w0.254: R29.1 64.63,71.14 U7.15
$2N136: length 6.2
  Top Layer w0.254: U7.6 69.71,56.76 70.3,56.17 71.64,56.17 72.29,55.52 72.29,54.4 R28.2
$3N6: length 10.9
  Top Layer w0.254: R33.2 33.83,48.89 34.97,47.75 U8.3 34.98,45.02 R31.1
$3N7: length 11
  Top Layer w0.254: R32.2 33.36,41.35 33.7,41.69 33.7,45.04 U8.2 33.73,45.07 33.73,46.74 33.35,47.12 R34.2
$3N10: length 4
  Top Layer w0.254: R32.1 32.43,42.87 U8.1 ; R35.1 32.4,42.85
$3N14: length 6.5
  Top Layer w0.254: U8.5 36.24,49.18 36.68,48.73 39.05,48.73 R36.2 39.06,48.72 R39.1
$3N18: length 5.8
  Top Layer w0.254: R40.1 34.44,55.03 R38.1 33.7,52.72 U8.7
$3N20: length 4.8
  Top Layer w0.254: R37.2 36.61,53.52 R40.2 34.97,53.38 U8.6
$3N21: length 9.3
  Top Layer w0.254: R47.2 62.11,40.36 ; 62.11,40.36 62.14,40.33 62.14,36.11 62.68,35.56 R50.2 ; 62.11,40.36 64.04,40.36 U9.6
$3N23: length 8.9
  Top Layer w0.254: R48.1 65.13,33.64 65.13,35.56 65.13,35.57 66.07,35.57 66.58,36.08 66.58,38.6 66.11,39.08 U9.7
$3N33: length 9.3
  Top Layer w0.254: R44.2 73.46,39.08 U9.2 68.11,39.08 67.53,38.49 R42.2
$3N34: length 5.8
  Top Layer w0.254: R41.1 73.61,40.62 R43.2 73.33,40.35 U9.3
$3N40: length 7.8
  Top Layer w0.254: C42.2 60.1,21.56 R51.2 63.83,21.5 U10.3
$3N50: length 6.1
  Top Layer w0.254: R54.3 96.98,35.88 R55.1 92.85,35.87 R53.2

## Copper pours and planes (outline as drawn; the poured copper is in the pictures)
1V65 on Top Layer: 62.73,26.24 65,26.24 65,22.27 62.73,22.27
3V3 on Top Layer: 28.4,17.44 32.43,17.44 32.43,8.59 28.4,8.59
3V3 on Top Layer: 30.88,18.68 40.45,18.68 40.45,8.87 30.88,8.87
+5V on Top Layer: 35.86,46.17 37.72,46.17 37.72,42.14 35.86,42.14
+5V on Top Layer: 43.4,17.24 60.26,17.24 60.26,14.54 43.4,14.54
+5V on Top Layer: 13.08,17.49 16.78,17.49 16.78,2.07 13.08,2.07
+5V on Top Layer: 51.29,61.49 52.75,61.49 52.75,15.99 51.29,15.99
+5V on Top Layer: 15.5,17.34 28.94,17.34 28.94,10.94 15.5,10.94
+5V on Top Layer: 59.58,16.89 62.25,16.89 62.25,14.69 59.58,14.69
+5V on Bottom Layer: 20.21,17.23 47.9,17.23 47.9,14.53 20.21,14.53
+12V on Top Layer: 4.48,26.06 18.81,26.06 18.81,21.12 4.48,21.12
+12V on Top Layer: 4.48,23.13 7.02,23.13 7.02,14.91 4.48,14.91
+12V on Top Layer: 6.56,17.85 7.63,17.85 7.63,16.9 6.56,16.9
+12V on Top Layer: 4.48,17.29 13.36,17.29 13.36,14.83 4.48,14.83
AGND on Inner1: -1.21,101.3 105.8,101.3 105.8,0 -1.21,0
GND on Top Layer: 42.28,60.05 44.27,60.05 44.27,57.05 42.28,57.05
GND on Top Layer: 43.08,58.06 44.9,58.06 44.9,56.57 43.08,56.57
GND on Top Layer: 66.81,60.03 68.8,60.03 68.8,57.03 66.81,57.03
GND on Top Layer: 67.32,58.12 69.29,58.12 69.29,56.39 67.32,56.39
GND on Top Layer: -3.13,102.23 104.55,102.23 104.55,-4.3 -3.13,-4.3
GND on Bottom Layer: -4.02,102.59 108.67,102.59 108.67,-4.56 -4.02,-4.56
VIN+ on Top Layer: 26.79,52.2 28.56,52.2 28.56,48.24 26.79,48.24
VIN+ on Top Layer: 0.59,95.36 31.09,95.36 31.09,38.77 0.59,38.77
VIN- on Top Layer: 3.8,53.54 28.43,53.54 28.43,43.79 3.8,43.79
HS-1 on Top Layer: 28.19,95.01 45.99,95.01 45.99,78.07 28.19,78.07
HS-2 on Top Layer: 56.18,95.36 68.72,95.36 68.72,82.52 56.18,82.52
HS-2 on Top Layer: 67.52,84.96 72.54,84.96 72.54,78.06 67.52,78.06
HS-2 on Bottom Layer: 62.08,95.36 72.54,95.36 72.54,83.18 62.08,83.18
VOUT+ on Top Layer: 80.67,60.79 83.22,60.79 83.22,58.91 80.67,58.91
VOUT+ on Top Layer: 69.11,95.09 96.72,95.09 96.72,60.57 69.11,60.57
VOUT+ on Top Layer: 6.61,40.93 11.16,40.93 11.16,38.76 6.61,38.76
VOUT+ on Inner2: 80.67,60.79 83.22,60.79 83.22,58.91 80.67,58.91
VOUT+ on Inner2: 8.59,40.95 11.17,40.95 11.17,38.78 8.59,38.78
VOUT- on Top Layer: 84.87,55.95 96.26,55.95 96.26,48.31 84.87,48.31
$1N9 on Top Layer: 2.48,35.85 17.54,35.85 17.54,29.6 2.48,29.6
$1N11 on Top Layer: 7.39,31.68 18.81,31.68 18.81,25.78 7.39,25.78
$2N113 on Top Layer: 31.01,69.53 39.19,69.53 39.19,67 31.01,67
$2N133 on Top Layer: 55.72,69.53 63.72,69.53 63.72,67 55.72,67
$3N26 on Top Layer: 60.25,44.26 65.15,44.26 65.15,41.2 60.25,41.2
$3N30 on Top Layer: 68.43,38.18 70.77,38.18 70.77,32.91 68.43,32.91

Small or netless copper shapes (teardrops, artwork), in the pictures only: 423 on Top Layer, 15 on Bottom Layer, 7 on Inner2

## Text on the board
Top Silkscreen Layer: “第十八届“啄木鸟杯—芯梦启航”科技竞赛活动” | 2300220325 / 2300220326 / 2300220328 | KEY2 | KEY1
